# EasyEDA Pro project GController.eprj, schematic NController, sheets 1 to 4 of 17

## Sheets
1 PowerSupply: Board Name: Board1; Create Date: 2024-08-13
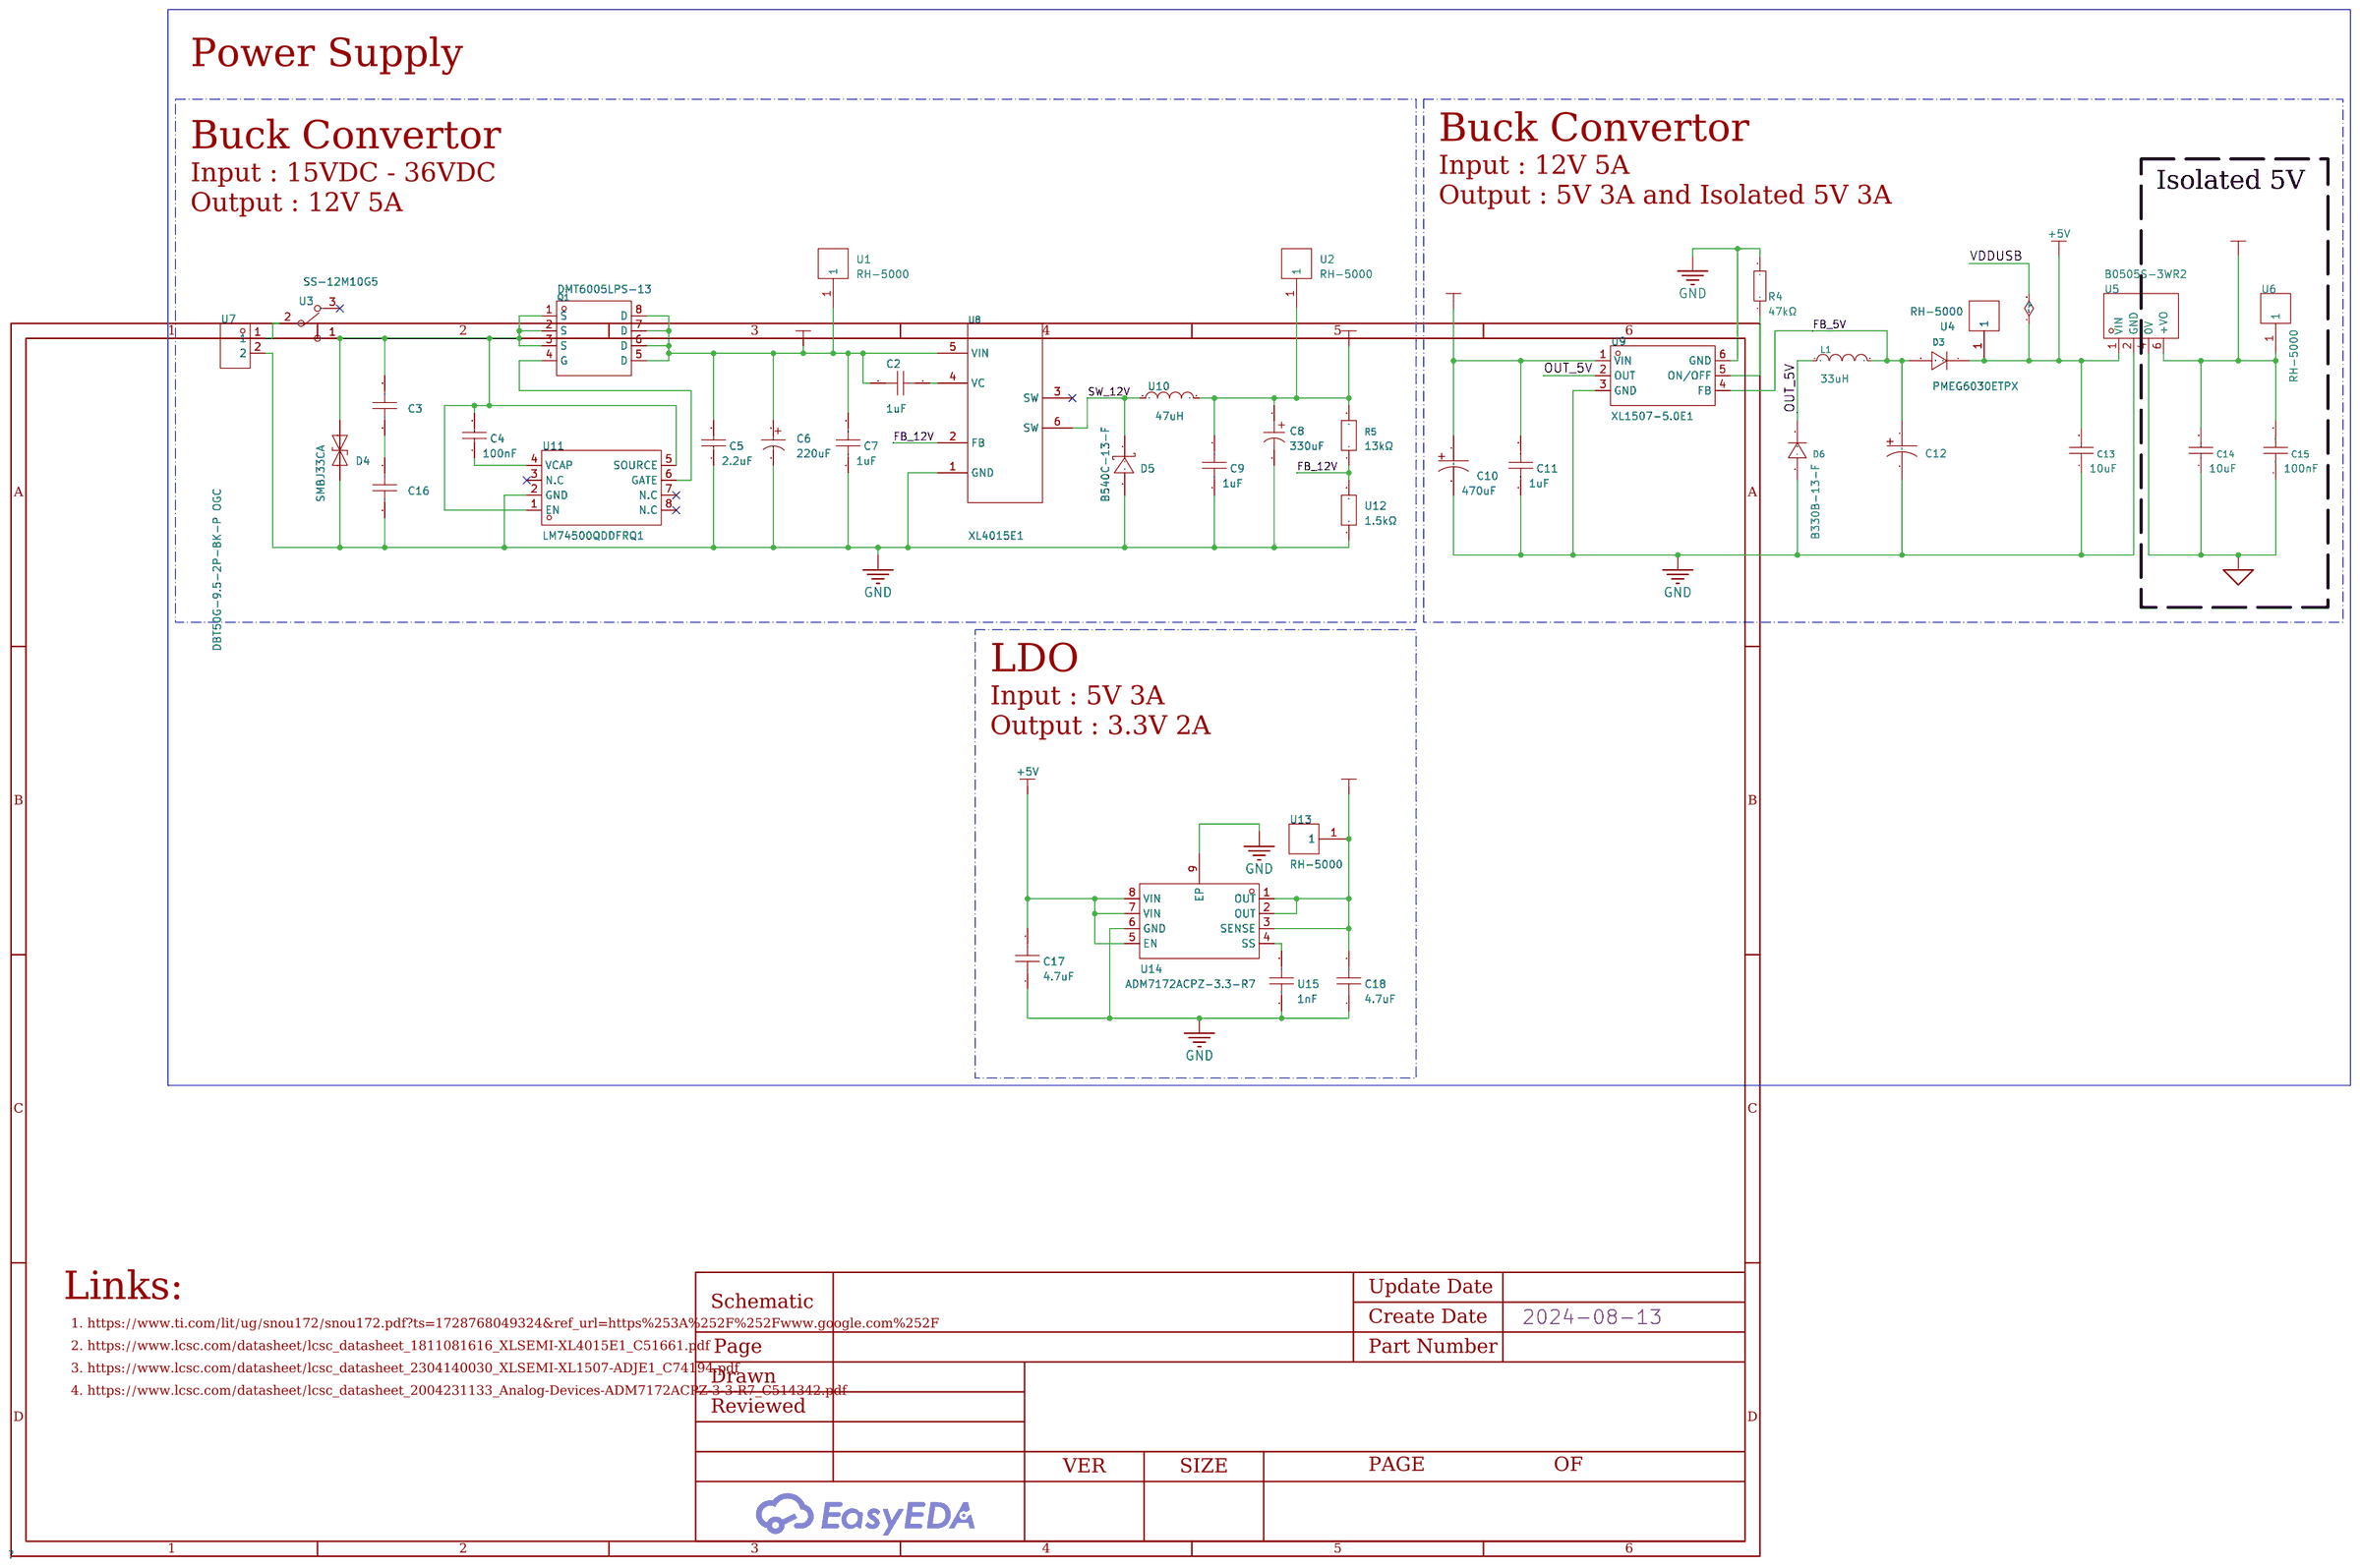
[diagram p0: PowerSupply]
2 ESP32-Display: Create Date: 2024-08-16
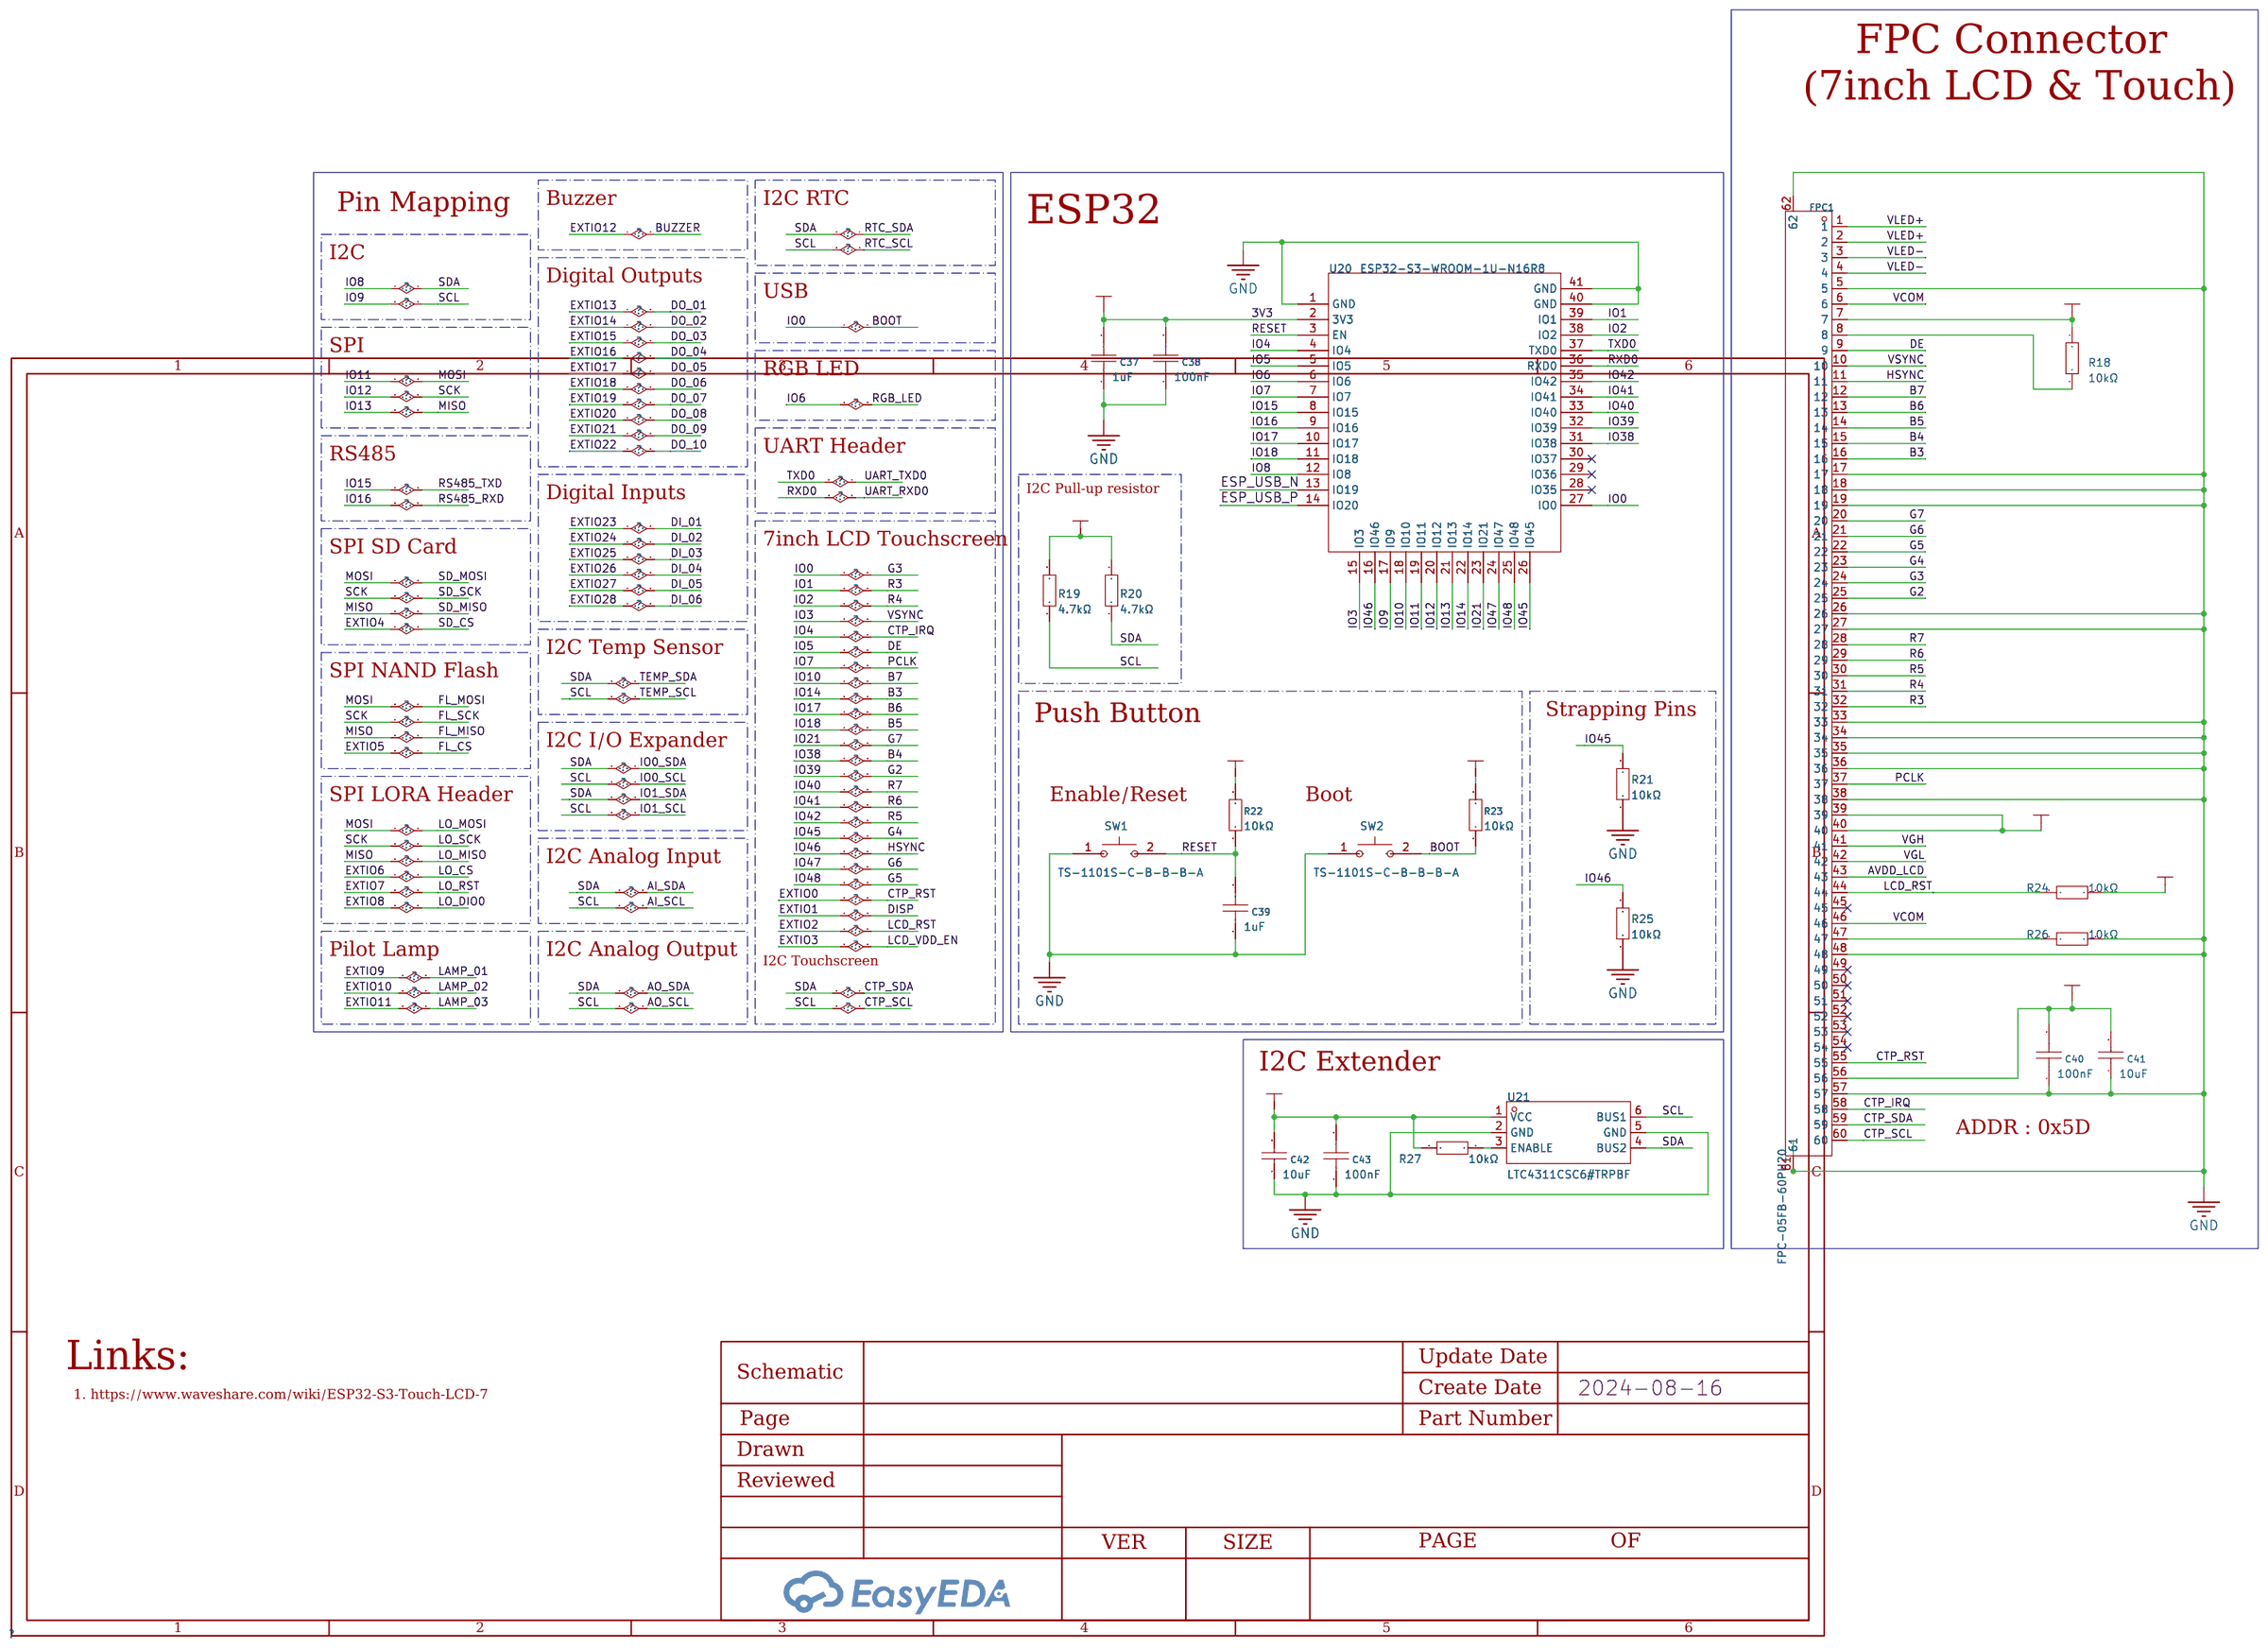
[diagram p1: ESP32-Display]
3 USB: Create Date: 2024-08-16
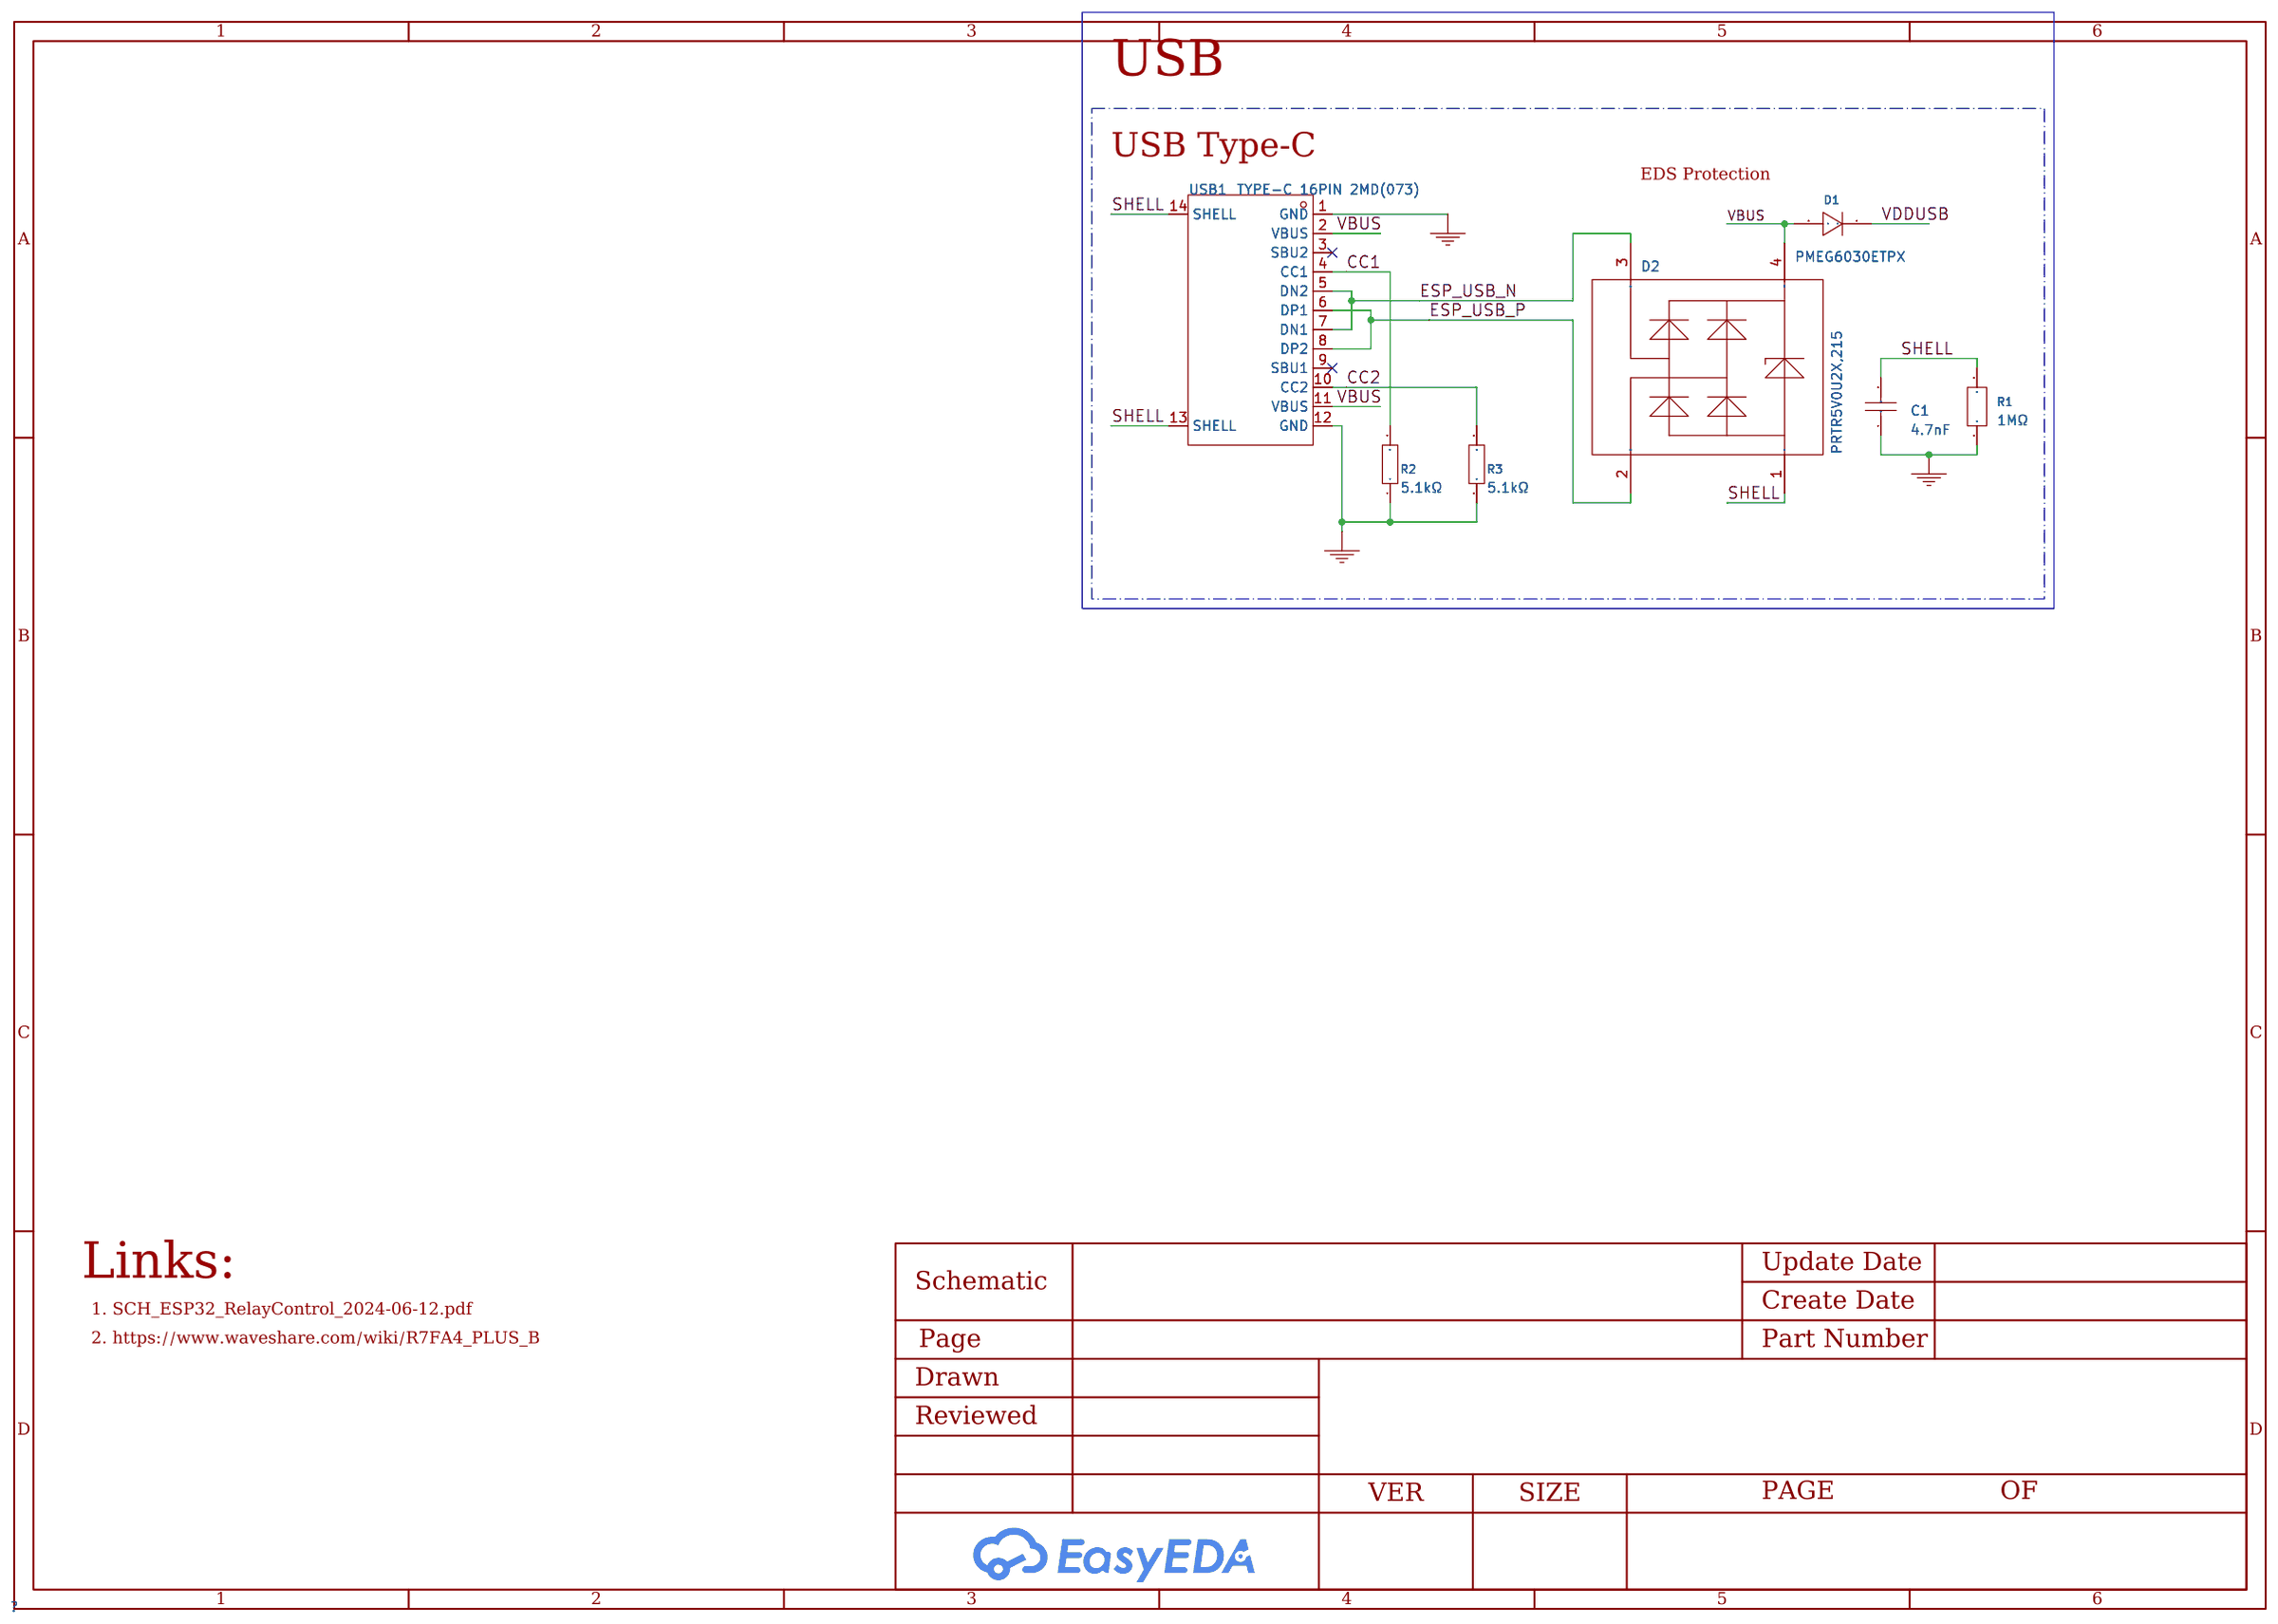
[diagram p2: USB]
4 Touchscreen-PowerSupply: Create Date: 2024-08-28
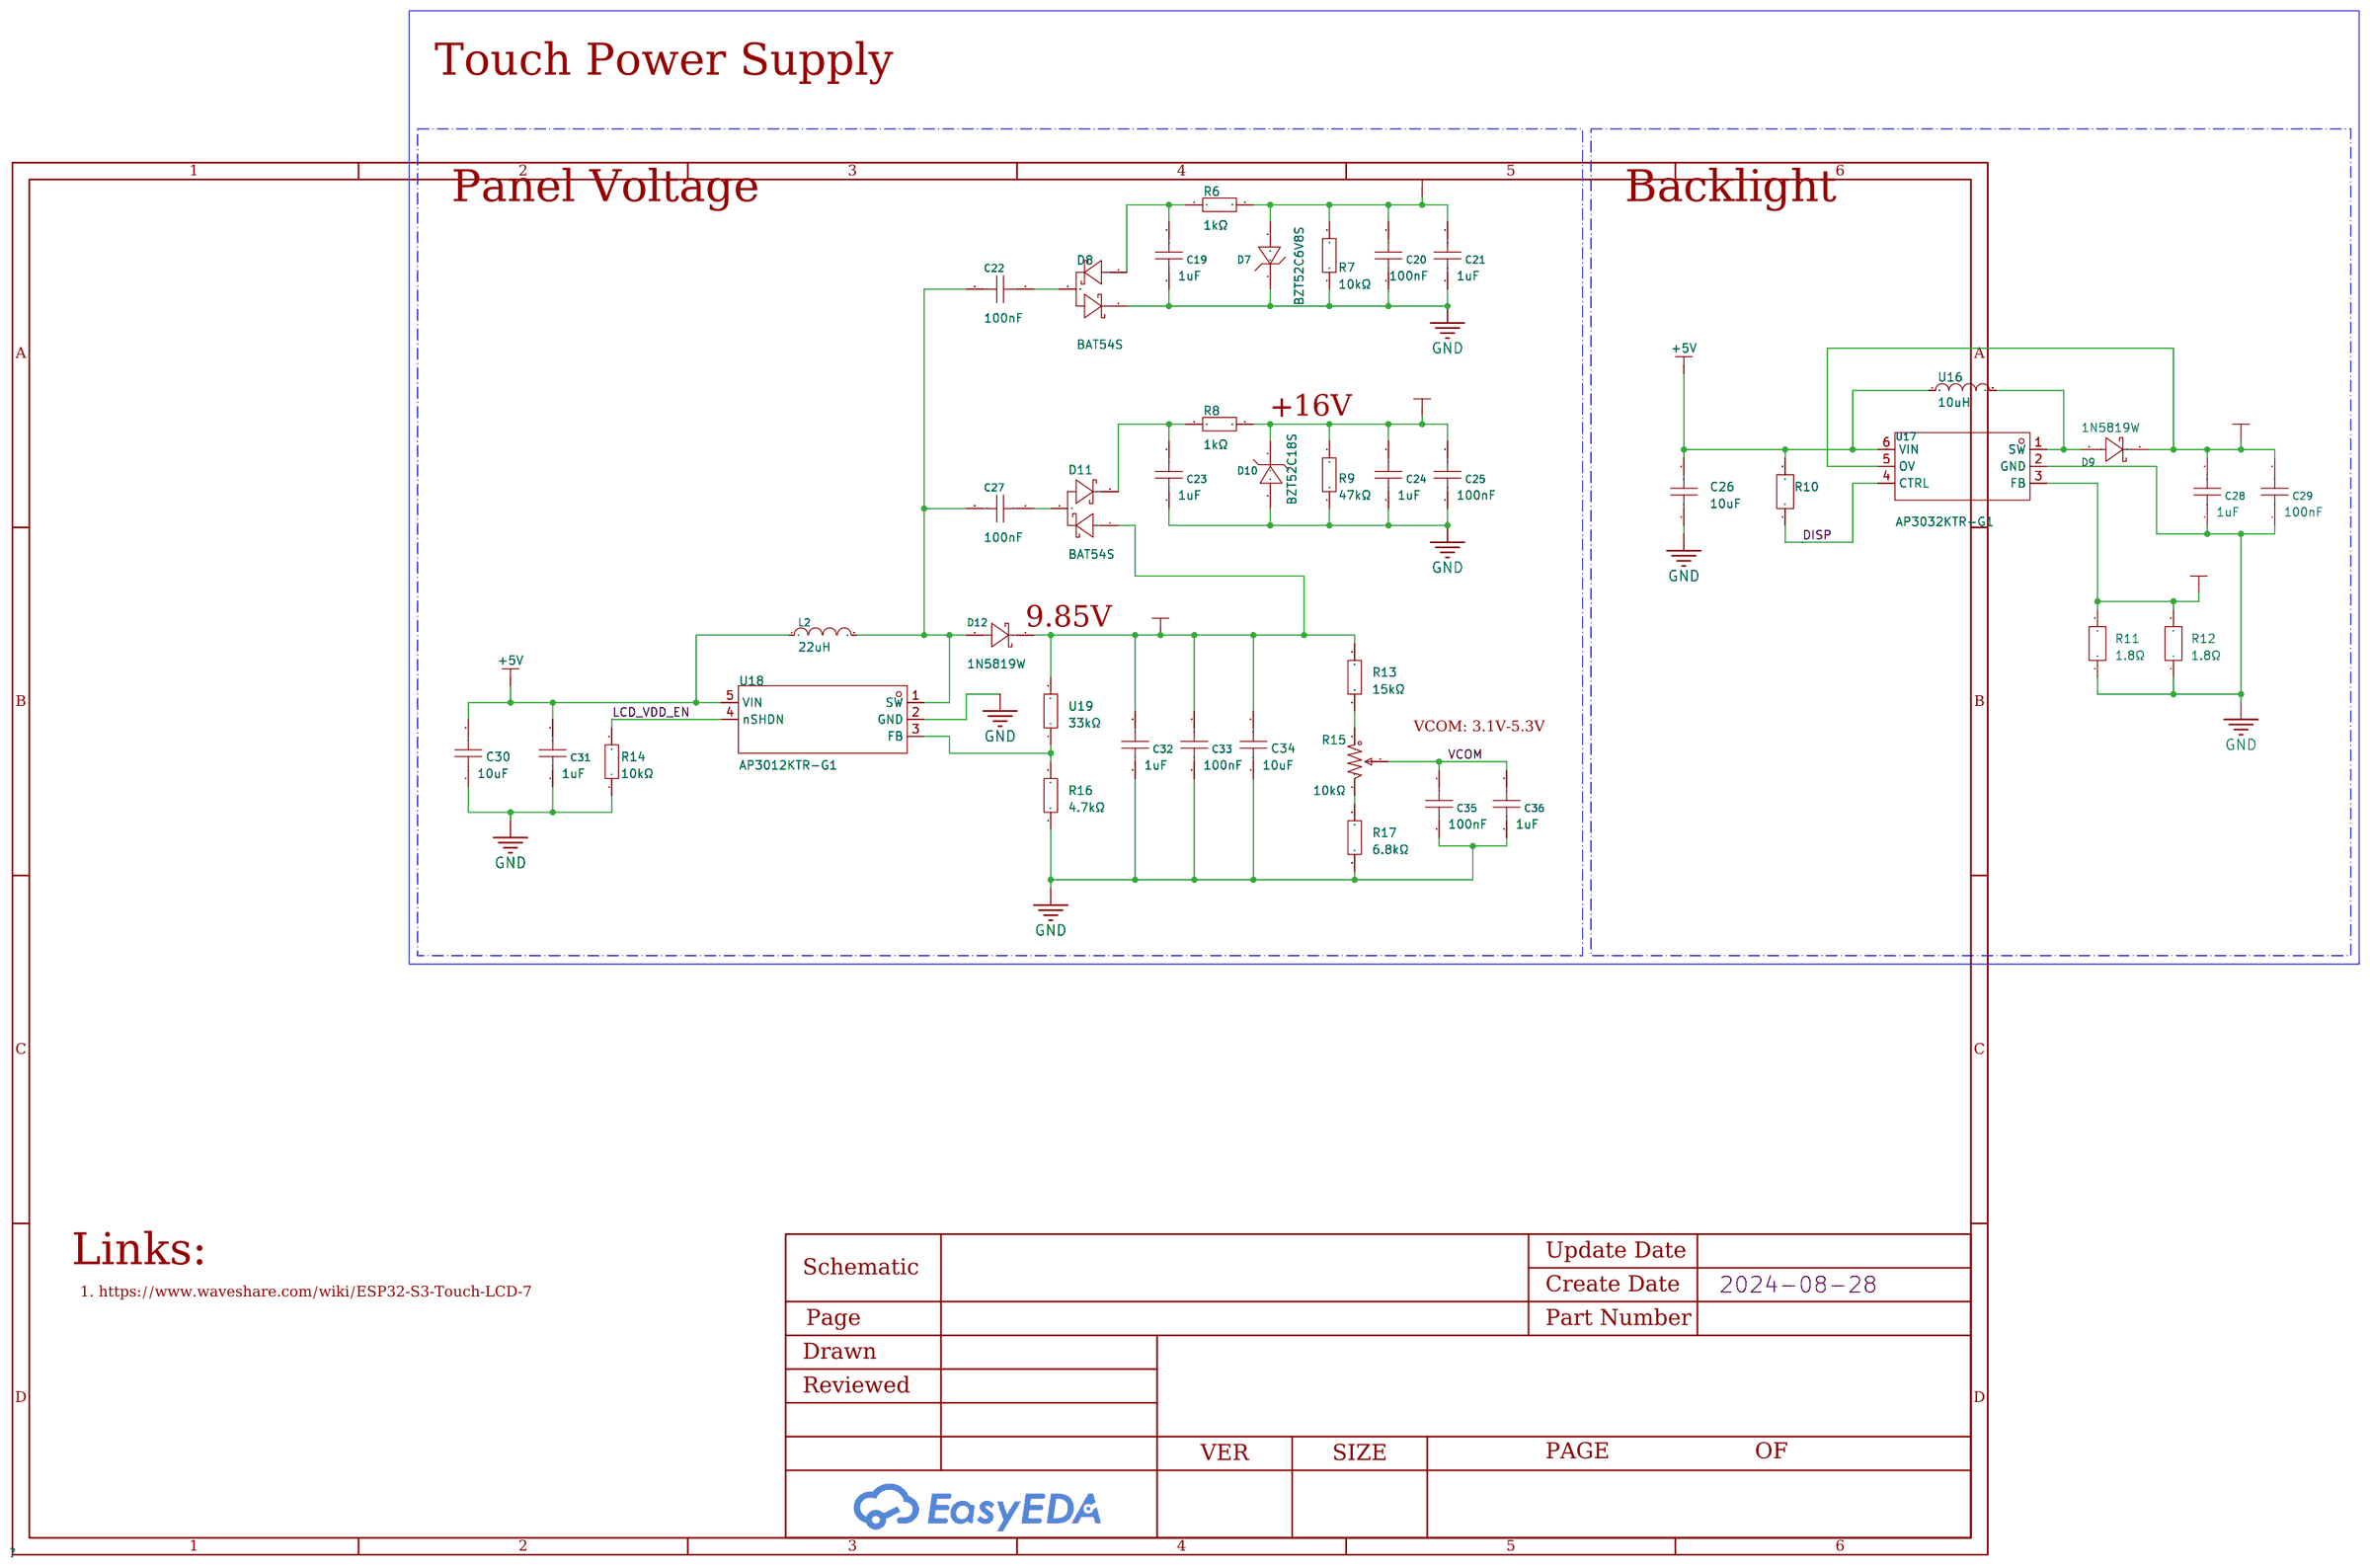
[diagram p3: Touchscreen-PowerSupply]

## Parts
sheet ESP32-Display
C37  1uF  [C0603]
C38  100nF  [C0603]
C39  1uF  [C0603]
C40  100nF  [C0402]
C41  10uF  [C0402]
C42  10uF  [C0402]
C43  100nF  [C0402]
FPC1  FPC-05FB-60PH20  [FPC-SMD_60P-P0.50_FPC-05FB-60PH20]
R18  10kΩ  [R0603]
R19  4.7kΩ  [R0603]
R20  4.7kΩ  [R0603]
R21  10kΩ  [R0603]
R22  10kΩ  [R0603]
R23  10kΩ  [R0603]
R24  10kΩ  [R0603]
R25  10kΩ  [R0603]
R26  10kΩ  [R0603]
R27  10kΩ  [R0402]
SW1  TS-1101S-C-B-B-B-A  [SW-SMD_L6.0-W3.5-LS8.0]
SW2  TS-1101S-C-B-B-B-A  [SW-SMD_L6.0-W3.5-LS8.0]
U20  ESP32-S3-WROOM-1U-N16R8  [WIRELM-SMD_ESP32-S3-WROOM-1U]
U21  LTC4311CSC6#TRPBF  [SC-70-6_L2.1-W1.3-P0.65-LS2.1-BR]
sheet PowerSupply
C2  1uF  [C0805]
C3  330nF  [C1206]
C4  100nF  [C0603]
C5  2.2uF  [C1210]
C6  220uF  [CAP-SMD_BD10.0-L10.3-W10.3-LS11.3-FD]
C7  1uF  [C0805]
C8  330uF  [CAP-SMD_BD6.3-L6.6-W6.6-LS7.3-FD]
C9  1uF  [C0805]
C10  470uF  [CAP-SMD_BD12.5-L13.0-W13.0-FD]
C11  1uF  [C0805]
C12  330uF  [CAP-SMD_BD10.0-L10.3-W10.3-LS11.3-FD]
C13  10uF  [C0805]
C14  10uF  [C0805]
C15  100nF  [C0805]
C16  330nF  [C1206]
C17  4.7uF  [C0805]
C18  4.7uF  [C0805]
D3  PMEG6030ETPX  [SOD-128_L3.7-W2.5-LS4.7-RD]
D4  SMBJ33CA  [SMB_L4.3-W3.6-LS5.4-BI]
D5  B540C-13-F  [SMC_L7.1-W6.2-LS8.1-RD]
D6  B330B-13-F  [SMB_L4.6-W3.6-LS5.3-RD]
L1  33uH  [IND-SMD_L12.0-W12.0]
Q1  DMT6005LPS-13  [DFN-8_L6.0-W5.1-P1.27-LS6.2-BL]
R4  47kΩ  [R0805]
R5  13kΩ  [R0805]
U1  RH-5000  [TEST-TH_BD2.54-P1.4_RED]
U2  RH-5000  [TEST-TH_BD2.54-P1.4_RED]
U3  SS-12M10G5  [SW-TH_XKB_SS-12M10G5]
U4  RH-5000  [TEST-TH_BD2.54-P1.4_RED]
U5  B0505S-3WR2  [PWRM-TH_B0505S-3WR2]
U6  RH-5000  [TEST-TH_BD2.54-P1.4_RED]
U7  DBT50G-9.5-2P-BK-P OGC  [CONN-TH_2P-P9.50_DBT50G-9.5-2P]
U8  XL4015E1  [TO-263-5_L10.2-W8.9-P1.70-TL]
U9  XL1507-5.0E1  [TO-252-5_L6.5-W5.6-P1.27-LS9.5-TL]
U10  47uH  [IND-SMD_L13.5-W12.5]
U11  LM74500QDDFRQ1  [SOT-23-8_L3.0-W1.7-P0.65-LS2.8-BR]
U12  1.5kΩ  [R0805]
U13  RH-5000  [TEST-TH_BD2.54-P1.4_RED]
U14  ADM7172ACPZ-3.3-R7  [DFN-8_L3.0-W3.0-P0.50-BL-EP]
U15  1nF  [C0805]
sheet Touchscreen-PowerSupply
C19  1uF  [C0603]
C20  100nF  [C0603]
C21  1uF  [C0603]
C22  100nF  [C0603]
C23  1uF  [C0603]
C24  1uF  [C0603]
C25  100nF  [C0603]
C26  10uF  [C0805]
C27  100nF  [C0603]
C28  1uF  [C0603]
C29  100nF  [C0603]
C30  10uF  [C0805]
C31  1uF  [C0603]
C32  1uF  [C0603]
C33  100nF  [C0603]
C34  10uF  [C0805]
C35  100nF  [C0603]
C36  1uF  [C0603]
D7  BZT52C6V8S  [SOD-323_L1.8-W1.3-LS2.5-RD]
D8  BAT54S  [SOT-23-3_L2.9-W1.3-P1.90-LS2.4-BR]
D9  1N5819W  [SOD-123_L2.8-W1.8-LS3.7-RD]
D10  BZT52C18S  [SOD-323_L1.8-W1.3-LS2.5-RD]
D11  BAT54S  [SOT-23-3_L2.9-W1.3-P1.90-LS2.4-BR]
D12  1N5819W  [SOD-123_L2.8-W1.8-LS3.7-RD]
L2  22uH  [IND-SMD_L4.9-W4.9_NRS50XX]
R6  1kΩ  [R0603]
R7  10kΩ  [R0603]
R8  1kΩ  [R0603]
R9  47kΩ  [R0603]
R10  4.7kΩ  [R0603]
R11  1.8Ω  [R0805]
R12  1.8Ω  [R0805]
R13  15kΩ  [R0603]
R14  10kΩ  [R0603]
R15  10kΩ  [RES-ADJ-SMD_3P-L3.0-W3.8-P1.75-BR]
R16  4.7kΩ  [R0603]
R17  6.8kΩ  [R0603]
U16  10uH  [IND-SMD_L4.4-W4.2_BCIHP0412SC]
U17  AP3032KTR-G1  [SOT-23-6_L2.9-W1.6-P0.95-LS2.8-BR]
U18  AP3012KTR-G1  [TSOT-23-5_L2.9-W1.6-P0.95-LS2.8-BL]
U19  33kΩ  [R0603]
sheet USB
C1  4.7nF  [C1206]
D1  PMEG6030ETPX  [SOD-128_L3.7-W2.5-LS4.7-RD]
D2  PRTR5V0U2X,215  [SOT-143_L2.9-W1.3-P1.92-LS2.3-BR]
R1  1MΩ  [R0402]
R2  5.1kΩ  [R0402]
R3  5.1kΩ  [R0402]
USB1  TYPE-C 16PIN 2MD(073)  [USB-C-SMD_TYPE-C-6PIN-2MD-073]

## Library data of the parts
C19 C21 C23 C24 C28 C31 C32 C36 C37 C39 = C0603X5R105K250NT: Capacitance: Tolerance:±10% Tolerance:±10% Voltage Rated: Temperature Coefficient:; LCSC Part Name: 1uF ±10% 25V; Supplier Part: C466771; Manufacturer: SANYEAR(叁叶源); Supplier Footprint: 0603; JLCPCB Part Class: Extended Part; Datasheet: https://atta.szlcsc.com/upload/public/pdf/source/20200102/C475251_1E30ECAC0E8AE7254982658A02A2D78C.pdf; Supplier: LCSC; Tolerance: ±10%
C38 = CL10B104KB8NNNC: Capacitance: Tolerance:±10% Tolerance:±10% Voltage Rated: Temperature Coefficient:; LCSC Part Name: 100nF ±10% 50V; Supplier Part: C1591; Manufacturer: SAMSUNG(三星); Supplier Footprint: 0603; JLCPCB Part Class: Extended Part; Datasheet: https://atta.szlcsc.com/upload/public/pdf/source/20160218/1457707763339.pdf; Supplier: LCSC; Tolerance: ±10%
C40 C43 = GRM155R71H104KE14D: LCSC Part Name: 100nF ±10% 50V; Supplier Part: C77020; Manufacturer: muRata(村田); Supplier Footprint: 0402; JLCPCB Part Class: Extended Part; Datasheet: https://atta.szlcsc.com/upload/public/pdf/source/20180326/C77020_39BD49C951FF1AF0DB1F1FAC5AC1E401.pdf; Supplier: LCSC; Tolerance: ±10%
C41 C42 = CL05A106MQ5NUNC: LCSC Part Name: 10uF ±20% 6.3V; Supplier Part: C15525; Manufacturer: SAMSUNG(三星); Supplier Footprint: 0402; JLCPCB Part Class: Basic Part; Datasheet: https://atta.szlcsc.com/upload/public/pdf/source/20220823/2B02EE04F8F211D38A52DCB16EB6BEBA.pdf; Supplier: LCSC; Tolerance: ±20%
FPC1 = FPC-05FB-60PH20: LCSC Part Name: 间距:0.5mm P数:60P 翻盖式 双侧触点/上下接; Supplier Part: C2856839; Manufacturer: XUNPU(讯普); Supplier Footprint: SMD,P=0.5mm,卧贴; JLCPCB Part Class: Extended Part; Datasheet: https://atta.szlcsc.com/upload/public/pdf/source/20210922/C2856839_B700DB1A2B95976B214AB1FEFC031E2B.pdf; Supplier: LCSC; Locking Feature: Clamshell; Contact Type: Double-sided contacts/up and down connection; Number of Contacts: 60P; Pitch: 0.5mm; Mounting Type: 卧贴; FFC, FCB Thickness: 0.3mm; Height Above Board: 2mm; Operating Temperature Range: -25℃~+85℃
R7 R14 R18 R21 R24-R26 = RC0603FR-0710KL: Type:Thick Film Resistors Resistance: Tolerance:±1% Tolerance:±1% Power(Watts): Overload Voltage (Max): Temperature Coefficient:±100ppm/℃ Temperature Coefficient:±100ppm/℃ Operating Temperature Range:-55℃~+155℃ Operating Temperature Range:-55℃~+155℃; LCSC Part Name: 厚膜电阻 10kΩ ±1% 100mW; Supplier Part: C98220; Manufacturer: YAGEO(国巨); Supplier Footprint: 0603; JLCPCB Part Class: Extended Part; Datasheet: https://atta.szlcsc.com/upload/public/pdf/source/20180927/C295883_E8D83085EA81BD7DE0B2B681138C15EE.pdf; Supplier: LCSC; Type: Thick Film Resistors; Tolerance: ±1%; Temperature Coefficient: ±100ppm/℃; Operating Temperature Range: -55℃~+155℃
R16 R19 R20 = RC0603FR-074K7L: Type:Thick Film Resistors Resistance: Tolerance:±1% Tolerance:±1% Power(Watts): Overload Voltage (Max): Temperature Coefficient:±100ppm/℃ Temperature Coefficient:±100ppm/℃ Operating Temperature Range:-55℃~+155℃ Operating Temperature Range:-55℃~+155℃; LCSC Part Name: 厚膜电阻 4.7kΩ ±1% 100mW; Supplier Part: C99782; Manufacturer: YAGEO(国巨); Supplier Footprint: 0603; JLCPCB Part Class: Extended Part; Datasheet: https://atta.szlcsc.com/upload/public/pdf/source/20180224/C181757_15194369480721363983.pdf; Supplier: LCSC; Type: Thick Film Resistors; Tolerance: ±1%; Temperature Coefficient: ±100ppm/℃; Operating Temperature Range: -55℃~+155℃
R22 R23 = CR0603FA1002G: Type:Thick Film Resistors Resistance: Tolerance:±1% Tolerance:±1% Power(Watts): Overload Voltage (Max): Temperature Coefficient:±100ppm/℃ Temperature Coefficient:±100ppm/℃ Operating Temperature Range:-55℃~+125℃ Operating Temperature Range:-55℃~+125℃; LCSC Part Name: 厚膜电阻 10kΩ ±1% 100mW; Supplier Part: C126901; Manufacturer: LIZ(丽智电子); Supplier Footprint: 0603; JLCPCB Part Class: Extended Part; Datasheet: https://atta.szlcsc.com/upload/public/pdf/source/20180403/C189438_6D658388CC7843F35BBC9018D03F0B8E.pdf; Supplier: LCSC; Type: Thick Film Resistors; Tolerance: ±1%; Temperature Coefficient: ±100ppm/℃; Operating Temperature Range: -55℃~+125℃
R27 = RC0402FR-0710KL: LCSC Part Name: 厚膜电阻 10kΩ ±1% 62.5mW; Supplier Part: C60490; Manufacturer: YAGEO(国巨); Supplier Footprint: 0402; JLCPCB Part Class: Extended Part; Datasheet: https://atta.szlcsc.com/upload/public/pdf/source/20170925/C131467_1506321478108990263.pdf; Supplier: LCSC; Type: Thick Film Resistors; Tolerance: ±1%; Temperature Coefficient: ±100ppm/℃; Operating Temperature Range: -55℃~+155℃
SW1 SW2 = TS-1101S-C-B-B-B-A: Circuit:SPST Actuator Style:Rectangle button Operating Force:260gf Mounting Style:Brick nogging Switch Length:6mm Switch Width:3.5mm Switch Height:5mm Strike Gundam:不带 Contact Current:50mA Voltage Rating (DC):12V Insulation Resistance:- Actuator/Cap Color; LCSC Part Name: 6*3.5*5mm 立贴 轻触开关; Supplier Part: C609852; Manufacturer: XKB Connectivity(中国星坤); Supplier Footprint: SMD; JLCPCB Part Class: Extended Part; Datasheet: https://atta.szlcsc.com/upload/public/pdf/source/20211011/FB5BEC18F2E7B990941A3F47A2FD4F18.pdf; Supplier: LCSC; Circuit: SPST; Actuator Style: Rectangle button; Operating Force: 260gf; Mounting Style: Brick nogging; Switch Length: 6mm; Switch Width: 3.5mm; Switch Height: 5mm; Strike Gundam: 不带; Contact Current: 50mA; Voltage Rating (DC): 12V; Actuator/Cap Color: Black; With Lamp: No; Mechanical Life: 5万次; Operating Temperature: -20℃~+70℃
U20 = ESP32-S3-WROOM-1U-N16R8: Supplier Part: C3013946; Manufacturer: ESPRESSIF(乐鑫); Supplier Footprint: SMD,18x19.2mm; JLCPCB Part Class: Extended Part; Datasheet: https://atta.szlcsc.com/upload/public/pdf/source/20240130/9D71F4DF55874C504AB629FEEE3F038E.pdf; Supplier: LCSC
U21 = LTC4311CSC6#TRPBF: LCSC Part Name: 低电压 I2C/SMBus 加速器; Supplier Part: C580856; Manufacturer: ADI(亚德诺); Supplier Footprint: SC-70-6; JLCPCB Part Class: Extended Part; Datasheet: https://atta.szlcsc.com/upload/public/pdf/source/20200917/C688093_6F50F7943BC708E0A1A0977BB3FF79B5.pdf; Supplier: LCSC; Type: Accelerator; Input Type: 2-WireBus; Output Type: 2-WireBus; Supply Voltage: 1.6V~5.5V; Number of Channels: 1; Operating Temperature: 0℃~+70℃; Application: I2C
C2 C7 C9 C11 = 0805B105K500NT_C215803: Capacitance:1uF Tolerance:±10% Tolerance:±10% Voltage Rated: Temperature Coefficient:; LCSC Part Name: 1uF ±10% 50V; Supplier Part: C215803; Manufacturer: FH(风华); Manufacturer Part: 0805B105K500NT; Supplier Footprint: 0805; JLCPCB Part Class: Extended Part; Datasheet: https://atta.szlcsc.com/upload/public/pdf/source/20180530/C215803_D57791C2287FC18831C4E0C7838E6BEC.pdf; Supplier: LCSC; Tolerance: ±10%
C3 C16 = CC1206KRX7R9BB334: Capacitance: Tolerance:±10% Tolerance:±10% Voltage Rated: Temperature Coefficient:; LCSC Part Name: 330nF ±10% 50V; Supplier Part: C274377; Manufacturer: YAGEO(国巨); Supplier Footprint: 1206; JLCPCB Part Class: Extended Part; Datasheet: https://atta.szlcsc.com/upload/public/pdf/source/20181008/C309510_22F155564471FAF6A489F7D68F34234E.pdf; Supplier: LCSC; Tolerance: ±10%
C4 = CL10B104KA8NNNC: LCSC Part Name: 100nF ±10% 25V; Supplier Part: C1590; Manufacturer: SAMSUNG(三星); Supplier Footprint: 0603; JLCPCB Part Class: Extended Part; Datasheet: https://atta.szlcsc.com/upload/public/pdf/source/20160218/1457707763339.pdf; Supplier: LCSC; Tolerance: ±10%
C5 = CL32B225KCJSNNE: LCSC Part Name: 2.2uF ±10% 100V; Supplier Part: C55151; Manufacturer: SAMSUNG(三星); Supplier Footprint: 1210; JLCPCB Part Class: Extended Part; Datasheet: https://atta.szlcsc.com/upload/public/pdf/source/20160218/1457707763339.pdf; Supplier: LCSC; Tolerance: ±10%
C6 = RVT1H221M1010_C72499: Capacitance: Tolerance:±20% Tolerance:±20% Rated Voltage: Ripple Current:230mA@120Hz Equivalent Series Resistance(ESR):- φD: L: Lifetime @ Temp:2000hrs@105℃ Operating Temperature:-40℃~+105℃ Operating Temperature:-40℃~+105℃; LCSC Part Name: 220uF ±20% 50V; Supplier Part: C72499; Manufacturer: ROQANG(容强); Manufacturer Part: RVT1H221M1010; Supplier Footprint: SMD,D10xL10.2mm; JLCPCB Part Class: Extended Part; Datasheet: https://atta.szlcsc.com/upload/public/pdf/source/20170325/1490427950282.pdf; Supplier: LCSC; Tolerance: ±20%; Ripple Current: 230mA@120Hz; Lifetime @ Temp: 2000hrs@105℃; Operating Temperature: -40℃~+105℃
C8 = GVM1E331M0607: LCSC Part Name: 330uF ±20% 25V; Supplier Part: C2980171; Manufacturer: HONOR(荣誉); Supplier Footprint: SMD,D6.3xL7.7mm; JLCPCB Part Class: Extended Part; Datasheet: https://atta.szlcsc.com/upload/public/pdf/source/20220509/EB2A569F0F3393644DE07704993C28AA.pdf; Supplier: LCSC; Tolerance: ±20%; Lifetime @ Temp: 2000hrs@105℃; Operating Temperature: -55℃~+105℃
C10 = VT1H471MI135000CE0: LCSC Part Name: 470uF ±20% 50V; Supplier Part: C191227; Manufacturer: HUAWEI(华威集团); Supplier Footprint: SMD,D12.5xL13.5mm; JLCPCB Part Class: Extended Part; Datasheet: https://atta.szlcsc.com/upload/public/pdf/source/20180905/C271440_3CFD575A076F93250B03C17D9BA3B978.pdf; Supplier: LCSC; Tolerance: ±20%; Lifetime @ Temp: 1000hrs@105℃; Operating Temperature: -40℃~+105℃
C12 = RVE1V331M1010_C88682: Capacitance: Tolerance:±20% Tolerance:±20% Rated Voltage: Ripple Current:- Equivalent Series Resistance(ESR):- φD: L: Lifetime @ Temp:2000hrs@105℃ Operating Temperature:-55℃~+105℃ Operating Temperature:-55℃~+105℃; LCSC Part Name: 330uF ±20% 35V; Supplier Part: C88682; Manufacturer: HONOR(荣誉); Manufacturer Part: RVE1V331M1010; Supplier Footprint: SMD,D10xL10.2mm; JLCPCB Part Class: Extended Part; Datasheet: https://atta.szlcsc.com/upload/public/pdf/source/20180326/C88681_F49340D40E14C975B06CFC1ADD63F7A4.pdf; Supplier: LCSC; Tolerance: ±20%; Lifetime @ Temp: 2000hrs@105℃; Operating Temperature: -55℃~+105℃
C13 C14 = CL21A106KOQNNNE: Capacitance: Tolerance:±10% Tolerance:±10% Voltage Rated: Temperature Coefficient:; LCSC Part Name: 10uF ±10% 16V; Supplier Part: C1713; Manufacturer: SAMSUNG(三星); Supplier Footprint: 0805; JLCPCB Part Class: Extended Part; Datasheet: https://atta.szlcsc.com/upload/public/pdf/source/20160218/1457707763339.pdf; Supplier: LCSC; Tolerance: ±10%
C15 = C0805B104K500NT: Capacitance: Tolerance:±10% Tolerance:±10% Voltage Rated: Temperature Coefficient:; LCSC Part Name: 100nF ±10% 50V; Supplier Part: C476766; Manufacturer: TORCH(火炬); Supplier Footprint: 0805; JLCPCB Part Class: Extended Part; Datasheet: https://atta.szlcsc.com/upload/public/pdf/source/20191230/C476766_171E30D5B7F7164A8210B8E948DFBAE0.pdf; Supplier: LCSC; Tolerance: ±10%
C17 C18 = HGC0805R7475K500NSLJ: LCSC Part Name: 4.7uF ±10% 50V; Supplier Part: C7472970; Manufacturer: Chinocera(华瓷); Supplier Footprint: 0805; JLCPCB Part Class: Extended Part; Datasheet: https://atta.szlcsc.com/upload/public/pdf/source/20240320/FAC3FEC40A78BC5CCCE96C232A94D860.pdf; Supplier: LCSC; Tolerance: ±10%; Voltage Rated: 50V
D1 D3 = PMEG6030ETPX: LCSC Part Name: 电压:60V 电流:3A; Supplier Part: C458168; Manufacturer: Nexperia(安世); Supplier Footprint: SOD-128; JLCPCB Part Class: Extended Part; Datasheet: https://atta.szlcsc.com/upload/public/pdf/source/20191121/C458168_3DBD69A204AC75E76FEF59A88011A92D.pdf; Supplier: LCSC; Forward Voltage (Vf@If): 530mV@3A; Reverse Voltage (Vr): 60V; Average Rectified Current (Io): 3A; Reverse Leakage Current (Ir): 200uA@60V
D4 = SMBJ33CA_C78420: Reverse Stand-Off Voltage (Vrwm):33V Maximum Clamping Voltage:53.3V Peak Pulse Current (Ipp)@10/1000us:11.3A Breakdown Voltage:36.7V Type:TVS; LCSC Part Name: 33V截止 11.3A峰值脉冲; Supplier Part: C78420; Manufacturer: Brightking(君耀电子); Supplier Footprint: SMB(DO-214AA); JLCPCB Part Class: Extended Part; Datasheet: https://atta.szlcsc.com/upload/public/pdf/source/20181127/C309995_EB3DFB9F9AEE5D2146ECD9FA5992A402.pdf; Supplier: LCSC; Reverse Stand-Off Voltage (Vrwm): 33V; Maximum Clamping Voltage: 53.3V; Peak Pulse Current (Ipp)@10/1000us: 11.3A; Breakdown Voltage: 36.7V; Type: TVS; polarity: Bi-Directional; Peak Pulse Power Dissipation (Ppp)@10/1000us: 600W
D5 = B540C-13-F: Forward Voltage (Vf@If):550mV@5A Reverse Voltage (Vr):40V Average Rectified Current (Io):5A Reverse Leakage Current (Ir):500uA@40V; LCSC Part Name: 电压:40V 电流:5A; Supplier Part: C72264; Manufacturer: DIODES(美台); Supplier Footprint: SMC(DO-214AB); JLCPCB Part Class: Extended Part; Datasheet: https://atta.szlcsc.com/upload/public/pdf/source/20171023/C134461_15087453602301052556.pdf; Supplier: LCSC; Forward Voltage (Vf@If): 550mV@5A; Reverse Voltage (Vr): 40V; Average Rectified Current (Io): 5A; Reverse Leakage Current (Ir): 500uA@40V
D6 = B330B-13-F: LCSC Part Name: 电压:30V 电流:3A; Supplier Part: C134450; Manufacturer: DIODES(美台); Supplier Footprint: SMB(DO-214AA); JLCPCB Part Class: Extended Part; Datasheet: https://atta.szlcsc.com/upload/public/pdf/source/20171023/C134455_15087453581191052550.pdf; Supplier: LCSC; Forward Voltage (Vf@If): 500mV@3A; Reverse Voltage (Vr): 30V; Average Rectified Current (Io): 3A; Reverse Leakage Current (Ir): 500uA@30V
L1 = SLH1207S330MTT: LCSC Part Name: 33uH ±20%; Supplier Part: C181844; Manufacturer: Sunltech(韩国顺磁); Supplier Footprint: SMD; JLCPCB Part Class: Extended Part; Datasheet: https://atta.szlcsc.com/upload/public/pdf/source/20180509/C216200_948378E1D3CCC25B70CFE5927CB2C576.pdf; Supplier: LCSC; Tolerance: ±20%
Q1 = DMT6005LPS-13: Supplier Part: C780843; Manufacturer: DIODES(美台); Supplier Footprint: DFN-8(5.1x6); JLCPCB Part Class: Extended Part; Datasheet: https://atta.szlcsc.com/upload/public/pdf/source/20200907/C780843_BB243DCE9D38AC8F9247AE6DAA9190FF.pdf; Supplier: LCSC
R4 = CR0805J80473G: Type:Thick Film Resistors Resistance: Tolerance:±5% Tolerance:±5% Power(Watts): Overload Voltage (Max): Temperature Coefficient:±200ppm/℃ Temperature Coefficient:±200ppm/℃ Operating Temperature Range:-55℃~+125℃ Operating Temperature Range:-55℃~+125℃; LCSC Part Name: 厚膜电阻 47kΩ ±5% 125mW; Supplier Part: C102018; Manufacturer: LIZ(丽智电子); Supplier Footprint: 0805; JLCPCB Part Class: Extended Part; Datasheet: https://atta.szlcsc.com/upload/public/pdf/source/20180403/C189438_6D658388CC7843F35BBC9018D03F0B8E.pdf; Supplier: LCSC; Type: Thick Film Resistors; Tolerance: ±5%; Temperature Coefficient: ±200ppm/℃; Operating Temperature Range: -55℃~+125℃
R5 = ERA6AEB133V: LCSC Part Name: 13kΩ ±0.1% 125mW 薄膜电阻; Supplier Part: C445658; Manufacturer: PANASONIC(松下); Supplier Footprint: 0805; JLCPCB Part Class: Extended Part; Supplier: LCSC; Type: Thin Film Resistor; Tolerance: ±0.1%; Temperature Coefficient: ±25ppm/℃; Operating Temperature Range: -55℃~+155℃
U1 U2 U4 U6 U13 = RH-5000: LCSC Part Name: PCB电路板测试点/测试针; Supplier Part: C5277086; Manufacturer: 荣和; JLCPCB Part Class: Extended Part; Datasheet: https://atta.szlcsc.com/upload/public/pdf/source/20230704/1671C2774A3D6CEDC1FD6AAF48538C87.pdf; Supplier: LCSC
U3 = SS-12M10G5: LCSC Part Name: 柄长5mm 直插双档 滑动开关; Supplier Part: C2884788; Manufacturer: XKB Connection(中国星坤); Supplier Footprint: 插件; JLCPCB Part Class: Extended Part; Datasheet: https://atta.szlcsc.com/upload/public/pdf/source/20211009/707226F904F6C200A894718D0972768B.pdf; Supplier: LCSC; Circuit: Single Pole Double Throw (SPDT); Actuator Style: Rectangular column; Pin Style: PCPin; Switch Length: 13.2mm; Switch Width: 7.2mm; Switch Height: 6.6mm; Mounting Style: Direct Insert; Actuator Color: Black; Current Rating (DC): 6A; Voltage Rating (DC): 120V; Current Rating (AC): 6A; Voltage Rating (AC): 120V; Mechanical Life: 10,000 times; Operating Temperature: -40℃~+85℃
U5 = B0505S-3WR2_C5369498: LCSC Part Name: DC-DC 输入电压4.5V~5.5V 输出电压5V输出功率3W600mA; Supplier Part: C5369498; Manufacturer: YLPTEC(易川); Supplier Footprint: SIP-4; JLCPCB Part Class: Extended Part; Datasheet: https://atta.szlcsc.com/upload/public/pdf/source/20230417/78355FDB466A614ED9BF545F60A618F8.pdf; Supplier: LCSC
U7 = DBT50G-9.5-2P-BK-P OGC: Barrier Type:With Cover Plate Pitch:9.5mm Structure:1x2P Mounting Style:Straight Needle Pin Location:Corner Number of Pins:2P Number of Rows:1 Current Rating (Max):32A Voltage Rating (Max):750V Wire Gauge - AWG:12~22 Wire Gauge - mm2:4 Operating Temperatu; LCSC Part Name: 9.5mm 1x2P 每排P数:2 排数:1 直针 边脚; Supplier Part: C395958; Manufacturer: DORABO(地博电气); Supplier Footprint: 插件,P=9.5mm; JLCPCB Part Class: Extended Part; Datasheet: https://atta.szlcsc.com/upload/public/pdf/source/20230619/13ADDB604F78DE06B1EFD4F82CE20A46.pdf; Supplier: LCSC; Barrier Type: With Cover Plate; Pitch: 9.5mm; Structure: 1x2P; Mounting Style: Straight Needle; Pin Location: Corner; Number of Pins: 2P; Number of Rows: 1; Current Rating (Max): 32A; Voltage Rating (Max): 750V; Wire Gauge - AWG: 12~22; Wire Gauge - mm2: 4; Operating Temperature Range: -40℃~+105℃; Color: Black; Number of PINs Per Row: 2
U8 = XL4015E1: Supplier Part: C51661; Manufacturer: XLSEMI(芯龙); Supplier Footprint: TO-263-5; JLCPCB Part Class: Extended Part; Datasheet: https://atta.szlcsc.com/upload/public/pdf/source/20150618/1457707323461.pdf; Supplier: LCSC; Function: Step-down type; Switch tube (built-in/external): 内置
U9 = XL1507-5.0E1: Supplier Part: C74195; Manufacturer: XLSEMI(芯龙); Supplier Footprint: TO-252-5; JLCPCB Part Class: Extended Part; Datasheet: https://atta.szlcsc.com/upload/public/pdf/source/20160525/1464169836651.pdf; Supplier: LCSC
U10 = CXP1265-470M-HG(47UH): LCSC Part Name: 47uH ±20% 6.5A; Supplier Part: C7461747; Manufacturer: DMBJ(振宝佳); Supplier Footprint: SMD,D13.5xL12.5mm; JLCPCB Part Class: Extended Part; Supplier: LCSC; Tolerance: ±20%; Rated Current: 5A; Saturation Current (Isat): 6.5A
U11 = LM74500QDDFRQ1: LCSC Part Name: 反极性保护控制器; Supplier Part: C5219210; Manufacturer: TI(德州仪器); Supplier Footprint: SOT-23-8-THIN; JLCPCB Part Class: Extended Part; Datasheet: https://www.ti.com/cn/lit/gpn/lm74500-q1; Supplier: LCSC; Input Voltage: 3.2V~65V; Operating Temperature	-: -40℃~+125℃
U12 = ARG05BTC1501: LCSC Part Name: 薄膜电阻 1.5kΩ ±0.1% 125mW; Supplier Part: C2828734; Manufacturer: Viking(光颉); Supplier Footprint: 0805; JLCPCB Part Class: Extended Part; Datasheet: https://atta.szlcsc.com/upload/public/pdf/source/20211009/C2828883_CAE7D170B8B230FC4A048BDC7B3A81FC.pdf; Supplier: LCSC; Type: Thin Film Resistor; Tolerance: ±0.1%; Temperature Coefficient: ±25ppm/℃; Operating Temperature Range: -55℃~+155℃
U14 = ADM7172ACPZ-3.3-R7: LCSC Part Name: 输入6.5V 输出3.3V 2A; Supplier Part: C514342; Manufacturer: ADI(亚德诺); Supplier Footprint: LFCSP-8(3x3); JLCPCB Part Class: Extended Part; Datasheet: https://atta.szlcsc.com/upload/public/pdf/source/20200415/C514342_F56C054F4D9836E2AE1A905E0604845B.pdf; Supplier: LCSC; Maximum Input Voltage: 6.5V; Output Voltage: 3.3V; MAX Output Current: 2A; Power Supply Rejection Ratio (PSRR): 60dB@(1kHz); Dropout Voltage: 270mV@2A; standby current: 2mA; Noise: 6uVrms; Feature: enable；Soft start; Operating Temperature: -40℃~+125℃@(Tj); Output Polarity: Positive electrode; Number of Outputs: 1
U15 = FCC0805B102K102FT: LCSC Part Name: 1nF ±10% 1kV; Supplier Part: C5137645; Manufacturer: FOJAN(富捷); Supplier Footprint: 0805; JLCPCB Part Class: Extended Part; Datasheet: https://atta.szlcsc.com/upload/public/pdf/source/20220818/0EB3B7FB2F5648AC16609637FBA7DABE.pdf; Supplier: LCSC; Tolerance: ±10%
C20 C22 C25 C27 C29 C33 C35 = CC0603KRX7R9BB104: Capacitance: Tolerance:±10% Tolerance:±10% Voltage Rated: Temperature Coefficient:; LCSC Part Name: 100nF ±10% 50V; Supplier Part: C14663; Manufacturer: YAGEO(国巨); Supplier Footprint: 0603; JLCPCB Part Class: Basic Part; Datasheet: https://atta.szlcsc.com/upload/public/pdf/source/20180910/C282072_33301C7F631E79921B82A8DAC6BCC5B3.pdf; Supplier: LCSC; Tolerance: ±10%
C26 C30 C34 = CL21A106KAYNNNE_C15850: Capacitance: Tolerance:±10% Tolerance:±10% Voltage Rated: Temperature Coefficient:; LCSC Part Name: 10uF ±10% 25V; Supplier Part: C15850; Manufacturer: SAMSUNG(三星); Manufacturer Part: CL21A106KAYNNNE; Supplier Footprint: 0805; JLCPCB Part Class: Basic Part; Datasheet: https://atta.szlcsc.com/upload/public/pdf/source/20160218/1457707763339.pdf; Supplier: LCSC; Tolerance: ±10%
D7 = BZT52C6V8S_C266580: Supplier Part: C266580; Manufacturer: BORN(伯恩半导体); Supplier Footprint: SOD-323; JLCPCB Part Class: Extended Part; Datasheet: https://atta.szlcsc.com/upload/public/pdf/source/20180829/C266575_AED0603D8BB5155755942115610061C5.pdf; Supplier: LCSC; Diode Configuration: Single; Zener Voltage (Nom): 6.8V; Reverse Leakage Current (Ir): 2uA@4V; Zener Voltage (Range): 6.4V~7.2V; Power Dissipation: 200mW; Zener Impedance (Zzt): 15Ω
D8 D11 = BAT54S_C916425: Diode Configuration:1对串联式 Forward Voltage (Vf@If):800mV@100mA Reverse Voltage (Vr):30V Average Rectified Current (Io):200mA Reverse Leakage Current (Ir):2uA@25V; LCSC Part Name: 电压:30V 电流:200mA; Supplier Part: C916425; Manufacturer: JSMSEMI(杰盛微); Supplier Footprint: SOT-23; JLCPCB Part Class: Extended Part; Datasheet: https://atta.szlcsc.com/upload/public/pdf/source/20230807/4DC032BFF2527F74FFA5A2420773D8A6.pdf; Supplier: LCSC; Diode Configuration: 1对串联式; Forward Voltage (Vf@If): 800mV@100mA; Reverse Voltage (Vr): 30V; Average Rectified Current (Io): 200mA; Reverse Leakage Current (Ir): 2uA@25V
D9 D12 = 1N5819W_C727115: Diode Configuration:Single Forward Voltage (Vf@If):900mV@3A Reverse Voltage (Vr):40V Average Rectified Current (Io):1A Reverse Leakage Current (Ir):1mA@40V; LCSC Part Name: 电压:40V 电流:1A; Supplier Part: C727115; Manufacturer: TWGMC(台湾迪嘉); Supplier Footprint: SOD-123; JLCPCB Part Class: Extended Part; Datasheet: https://atta.szlcsc.com/upload/public/pdf/source/20220518/A32FD9482A1BC542ED9C09095620CB64.pdf; Supplier: LCSC; Diode Configuration: Single; Forward Voltage (Vf@If): 900mV@3A; Reverse Voltage (Vr): 40V; Average Rectified Current (Io): 1A; Reverse Leakage Current (Ir): 1mA@40V
D10 = BZT52C18S_C173446: Diode Configuration:Single Zener Voltage (Nom):18V Reverse Leakage Current (Ir):100nA@12.6V Zener Voltage (Range):16.8V~19.1V Zener Voltage (Range):16.8V~19.1V Power Dissipation:200mW Zener Impedance (Zzt):45Ω Tolerance:- Tolerance:-; Supplier Part: C173446; Manufacturer: MDD; Supplier Footprint: SOD-323; JLCPCB Part Class: Extended Part; Datasheet: https://atta.szlcsc.com/upload/public/pdf/source/20230823/808D44843A9B65A969625980AC8C1BE8.pdf; Supplier: LCSC; Diode Configuration: Single; Zener Voltage (Nom): 18V; Reverse Leakage Current (Ir): 100nA@12.6V; Zener Voltage (Range): 16.8V~19.1V; Power Dissipation: 200mW; Zener Impedance (Zzt): 45Ω
L2 = NRS5020T220MMGJV: Inductance: Tolerance:±20% Tolerance:±20% Rated Current: Saturation Current (Isat):900mA DC Resistance (DCR): Type:- Ratings:AEC-Q200; LCSC Part Name: 22uH ±20% 900mA; Supplier Part: C515385; Manufacturer: TAIYO YUDEN(太诱); Supplier Footprint: SMD,4.9x4.9mm; JLCPCB Part Class: Extended Part; Datasheet: https://atta.szlcsc.com/upload/public/pdf/source/20190329/C222848_0E03677360B3A1898B651728462F6FFE.pdf; Supplier: LCSC; Tolerance: ±20%; Saturation Current (Isat): 900mA; Ratings: AEC-Q200
R6 R8 = RC0603FR-071KL: Type:Thick Film Resistors Resistance: Tolerance:±1% Tolerance:±1% Power(Watts): Overload Voltage (Max): Temperature Coefficient:±100ppm/℃ Temperature Coefficient:±100ppm/℃ Operating Temperature Range:-55℃~+155℃ Operating Temperature Range:-55℃~+155℃; LCSC Part Name: 厚膜电阻 1kΩ ±1% 100mW; Supplier Part: C22548; Manufacturer: YAGEO(国巨); Supplier Footprint: 0603; JLCPCB Part Class: Extended Part; Datasheet: https://atta.szlcsc.com/upload/public/pdf/source/20180316/70C0E2BDAE7FCC62C531A5A58D202EE1.pdf; Supplier: LCSC; Type: Thick Film Resistors; Tolerance: ±1%; Temperature Coefficient: ±100ppm/℃; Operating Temperature Range: -55℃~+155℃
R9 = RC0603FR-0747KL: Type:Thick Film Resistors Resistance: Tolerance:±1% Tolerance:±1% Power(Watts): Overload Voltage (Max): Temperature Coefficient:±100ppm/℃ Temperature Coefficient:±100ppm/℃ Operating Temperature Range:-55℃~+155℃ Operating Temperature Range:-55℃~+155℃; LCSC Part Name: 厚膜电阻 47kΩ ±1% 100mW; Supplier Part: C105579; Manufacturer: YAGEO(国巨); Supplier Footprint: 0603; JLCPCB Part Class: Extended Part; Datasheet: https://atta.szlcsc.com/upload/public/pdf/source/20180316/70C0E2BDAE7FCC62C531A5A58D202EE1.pdf; Supplier: LCSC; Type: Thick Film Resistors; Tolerance: ±1%; Temperature Coefficient: ±100ppm/℃; Operating Temperature Range: -55℃~+155℃
R10 = ERA3VEB4701V: Type:Thin Film Resistor Resistance:4.7kΩ Tolerance:±0.1% Tolerance:±0.1% Power(Watts): Overload Voltage (Max): Temperature Coefficient:±25ppm/℃ Temperature Coefficient:±25ppm/℃ Operating Temperature Range:-55℃~+155℃ Operating Temperature Range:-55℃~+155℃; LCSC Part Name: 4.7kΩ ±0.1% 125mW 薄膜电阻; Supplier Part: C490795; Manufacturer: PANASONIC(松下); Supplier Footprint: 0603; JLCPCB Part Class: Extended Part; Datasheet: https://atta.szlcsc.com/upload/public/pdf/source/20200407/C490795_BD180C303136D23A530CEBEA0F60C9C2.pdf; Supplier: LCSC; Type: Thin Film Resistor; Tolerance: ±0.1%; Temperature Coefficient: ±25ppm/℃; Operating Temperature Range: -55℃~+155℃
R11 R12 = RC0805FR-071R8L: Type:Thick Film Resistors Resistance: Tolerance:±1% Tolerance:±1% Power(Watts): Overload Voltage (Max): Temperature Coefficient:±200ppm/℃ Temperature Coefficient:±200ppm/℃ Operating Temperature Range:-55℃~+155℃ Operating Temperature Range:-55℃~+155℃; LCSC Part Name: 厚膜电阻 1.8Ω ±1% 125mW; Supplier Part: C482990; Manufacturer: YAGEO(国巨); Supplier Footprint: 0805; JLCPCB Part Class: Extended Part; Datasheet: https://atta.szlcsc.com/upload/public/pdf/source/20200715/C482990_9DB74A2815C602721D2BD8256D955806.pdf; Supplier: LCSC; Type: Thick Film Resistors; Tolerance: ±1%; Temperature Coefficient: ±200ppm/℃; Operating Temperature Range: -55℃~+155℃
R13 = RT0603BRD0715KL: Type:Thin Film Resistor Resistance: Tolerance:±0.1% Tolerance:±0.1% Power(Watts): Overload Voltage (Max): Temperature Coefficient:±25ppm/℃ Temperature Coefficient:±25ppm/℃ Operating Temperature Range:-55℃~+155℃ Operating Temperature Range:-55℃~+155℃; LCSC Part Name: 薄膜电阻 15kΩ ±0.1% 100mW; Supplier Part: C326733; Manufacturer: YAGEO(国巨); Supplier Footprint: 0603; JLCPCB Part Class: Extended Part; Datasheet: https://atta.szlcsc.com/upload/public/pdf/source/20181031/C326733_EE8F7294E9D8CA9630183F76883336CF.pdf; Supplier: LCSC; Type: Thin Film Resistor; Tolerance: ±0.1%; Temperature Coefficient: ±25ppm/℃; Operating Temperature Range: -55℃~+155℃
R15 = TC33X-2-103E: LCSC Part Name: 10kΩ ±25%; Supplier Part: C719176; Manufacturer: BOURNS; Supplier Footprint: SMD-3P,3.8x3.6mm; JLCPCB Part Class: Extended Part; Datasheet: https://atta.szlcsc.com/upload/public/pdf/source/20200810/C720646_BB66A75E654D5E1D30127FF45BCD3C26.pdf; Supplier: LCSC; Tolerance: ±25%; Power(Watts): 150mW; Temperature Coefficient: ±250ppm/℃
R17 = RC0603JR-076K8L: Type:Thick Film Resistors Resistance: Tolerance:±5% Tolerance:±5% Power(Watts): Overload Voltage (Max): Temperature Coefficient:±100ppm/℃ Temperature Coefficient:±100ppm/℃ Operating Temperature Range:-55℃~+155℃ Operating Temperature Range:-55℃~+155℃; LCSC Part Name: 厚膜电阻 6.8kΩ ±5% 100mW; Supplier Part: C127446; Manufacturer: YAGEO(国巨); Supplier Footprint: 0603; JLCPCB Part Class: Extended Part; Datasheet: https://atta.szlcsc.com/upload/public/pdf/source/20180821/C275644_0D56F95EFF785E7D9A1FEF436B37DA78.pdf; Supplier: LCSC; Type: Thick Film Resistors; Tolerance: ±5%; Temperature Coefficient: ±100ppm/℃; Operating Temperature Range: -55℃~+155℃
U16 = BCIHP0420SC-100M: Inductance: Tolerance:±20% Tolerance:±20% Rated Current: Saturation Current (Isat): DC Resistance (DCR):282mΩ Q @ Freq:- Frequency - Self Resonant:-; LCSC Part Name: 10uH ±20% 2A; Supplier Part: C2921170; Manufacturer: BC(台湾诚阳); Supplier Footprint: SMD,4.2x4.4mm; JLCPCB Part Class: Extended Part; Datasheet: https://atta.szlcsc.com/upload/public/pdf/source/20220607/0F62A2B68923DD0945D5F83B99590D06.pdf; Supplier: LCSC; Tolerance: ±20%; DC Resistance (DCR): 282mΩ
U17 = AP3032KTR-G1: Type:DC-DCVoltage Stabilizer Input Voltage:2.7V~9V Input Voltage:2.7V~9V Switch Frequency:1MHz Switch Frequency:1MHz Channels:1 Output Voltage:- Output Voltage:- Output Current:1.4A Dimming:PWM Features:- Topology:boost converter Operating temperature:-40; LCSC Part Name: 输出1.4A 升压型驱动; Supplier Part: C264086; Manufacturer: DIODES(美台); Supplier Footprint: SOT-23-6; JLCPCB Part Class: Extended Part; Datasheet: https://atta.szlcsc.com/upload/public/pdf/source/20180814/C264086_E65DFFCFC0D5B7749C7C40AA828BCF4C.pdf; Supplier: LCSC; Type: DC-DCVoltage Stabilizer; Input Voltage: 2.7V~9V; Switch Frequency: 1MHz; Channels: 1; Output Current: 1.4A; Dimming: PWM; Topology: boost converter; Operating temperature: -40℃~+85℃
U18 = AP3012KTR-G1: Function:boost converterType Output Type:Adjustable Input Voltage:2.6V~16V Input Voltage:2.6V~16V Output Voltage:1.25V~29V Output Voltage:1.25V~29V Output Current (Max):500mA Switching Frequency:1.5MHz Operating Temperature:-40℃~+85℃@(TA) Operating Temper; Supplier Part: C102618; Manufacturer: DIODES(美台); Supplier Footprint: SOT-23-5; JLCPCB Part Class: Extended Part; Datasheet: https://atta.szlcsc.com/upload/public/pdf/source/20191127/C460356_AACB9653A67EC58211AB2AB041FDC9A0.pdf; Supplier: LCSC; Function: boost converterType; Output Type: Adjustable; Input Voltage: 2.6V~16V; Output Voltage: 1.25V~29V; Output Current (Max): 500mA; Switching Frequency: 1.5MHz; Operating Temperature: -40℃~+85℃@(TA); Synchronous Rectification: NO; Number of Outputs: 1; Topology: Boost; Switch tube (built-in/external): 内置
U19 = HPCR0603F33K0K9: Type:Thick Film Resistors Resistance: Tolerance:±1% Tolerance:±1% Power(Watts): Overload Voltage (Max): Temperature Coefficient:±100ppm/℃ Temperature Coefficient:±100ppm/℃ Operating Temperature Range:-55℃~+125℃ Operating Temperature Range:-55℃~+125℃; LCSC Part Name: 厚膜电阻 33kΩ ±1% 200mW; Supplier Part: C365146; Manufacturer: RESI(开步睿思); Supplier Footprint: 0603; JLCPCB Part Class: Extended Part; Datasheet: https://atta.szlcsc.com/upload/public/pdf/source/20200302/C492020_A67DFE56E3A0098A28FA0495227278A6.pdf; Supplier: LCSC; Type: Thick Film Resistors; Tolerance: ±1%; Temperature Coefficient: ±100ppm/℃; Operating Temperature Range: -55℃~+125℃
C1 = 1206B472K102NT: LCSC Part Name: 4.7nF ±10% 1kV; Supplier Part: C9192; Manufacturer: FH(风华); Supplier Footprint: 1206; JLCPCB Part Class: Extended Part; Datasheet: https://atta.szlcsc.com/upload/public/pdf/source/20200305/C486355_26A10D38EF8C2A5C37091D0039909270.pdf; Supplier: LCSC; Tolerance: ±10%
D2 = PRTR5V0U2X,215: polarity:Unidirectional Reverse Stand-Off Voltage (Vrwm):5.5V Breakdown Voltage:6V Number of Lines:双路 Operating Temperature:-40℃~+85℃@(Ta) Operating Temperature:-40℃~+85℃@(Ta) Type:ESD; LCSC Part Name: 单向ESD; Supplier Part: C12333; Manufacturer: Nexperia(安世); Supplier Footprint: SOT-143; JLCPCB Part Class: Extended Part; Datasheet: https://atta.szlcsc.com/upload/public/pdf/source/20171031/C12333_15094491572901070596.pdf; Supplier: LCSC; polarity: Unidirectional; Reverse Stand-Off Voltage (Vrwm): 5.5V; Breakdown Voltage: 6V; Number of Lines: 双路; Operating Temperature: -40℃~+85℃@(Ta); Type: ESD
R1 = ERJ2RKF1004X: LCSC Part Name: 1MΩ ±1% 100mW 厚膜电阻; Supplier Part: C413126; Manufacturer: PANASONIC(松下); Supplier Footprint: 0402; JLCPCB Part Class: Extended Part; Datasheet: https://atta.szlcsc.com/upload/public/pdf/source/20190820/C413126_40A6F45AA8A7BCF3A77EE1B92B10DD48.pdf; Supplier: LCSC; Type: Thick Film Resistors; Tolerance: ±1%; Temperature Coefficient: ±100ppm/℃; Operating Temperature Range: -55℃~+155℃
R2 R3 = RMC04025.1K1%N: LCSC Part Name: 5.1kΩ ±1% 62.5mW; Supplier Part: C325521; Manufacturer: Tyohm(幸亚电阻); Supplier Footprint: 0402; JLCPCB Part Class: Extended Part; Datasheet: https://atta.szlcsc.com/upload/public/pdf/source/20190115/C325956_D27151D492FFB3C9AB4A6F14FE01F30A.pdf; Supplier: LCSC; Tolerance: ±1%
USB1 = TYPE-C 16PIN 2MD(073): LCSC Part Name: Type-C 母 卧贴; Supplier Part: C2765186; Manufacturer: SHOU HAN(首韩); Supplier Footprint: SMD; JLCPCB Part Class: Extended Part; Datasheet: https://atta.szlcsc.com/upload/public/pdf/source/20211123/39B17C16241EAC15C5E277BDA434118E.pdf; Supplier: LCSC; Connector Type: Type-C; Standard: USB 3.1; Gender: Female; Mounting Style: Horizontal attachment; Number of Contacts: 16P; Number of Ports: 1; Current Rating - Power (Max): 5A; Operating Temperature Range: -25℃~+85℃; Rated Voltage (Max): 5V; Connect-Disconnect Life: 5000 Cuts; Core Colour: Black

## Nets
3V3: C18.2 C37.2 C38.2 C40.2 C41.2 C42.2 C43.2 FPC1.7 FPC1.39 FPC1.40 FPC1.56 R18.1 R19.2 R20.2 R22.2 R23.2 R24.2 R27.2 U13.1 U14.1(OUT) U14.2(OUT) U14.3(SENSE) U20.2(3V3) U21.1(VCC) ; also on sheet 5 6 7 8 9 10 11 12 14 15 16 17
+5V: C13.2 C17.2 C26.2 C30.2 C31.2 D1.1 D3.1 L2.1 R10.2 U4.1 U5.1(VIN) U14.5(EN) U14.7(VIN) U14.8(VIN) U16.1 U17.6(VIN) U18.5(VIN) ; also on sheet 14 15
+5V(ISO): C14.2 C15.2 U5.6(+VO) U6.1 ; also on sheet 5 9 15
+12V: C8.1 C9.2 C10.1 C11.2 R5.2 U2.1 U9.1(VIN) U10.2 ; also on sheet 13 15 16
+24V: C2.2 C5.2 C6.1 C7.2 Q1.5(D) Q1.6(D) Q1.7(D) Q1.8(D) U1.1 U8.5(VIN) ; also on sheet 15 16
AVDD_LCD: C32.2 C33.2 C34.2 D11.1(A) D12.1(C) FPC1.43 R13.2 U19.2
GND: C1.1 C5.1 C6.2 C7.1 C8.2 C9.1 C10.2 C11.1 C12.2 C13.1 C16.2 C17.1 C18.1 C19.1 C20.1 C21.1 C23.1 C24.1 C25.1 C26.1 C28.1 C29.1 C30.1 C31.1 C32.1 C33.1 C34.1 C35.2 C36.1 C37.1 C38.1 C39.1 C40.1 C41.1 C42.1 C43.1 D4.1 D5.2(A) D6.2(A) D7.1 D8.2(K) D10.2(A) FPC1.5 FPC1.17 FPC1.18 FPC1.19 FPC1.26 FPC1.27 FPC1.33 FPC1.34 FPC1.35 FPC1.36 FPC1.38 FPC1.48 FPC1.57 FPC1.61 FPC1.62 R1.1 R2.1 R3.1 R4.2 R7.1 R9.1 R11.1 R12.1 R14.1 R16.1 R17.1 R21.1 R25.1 R26.2 SW1.1 SW2.1 U5.2(GND) U7.2 U8.1(GND) U9.3(GND) U9.6(GND) U11.2(GND) U12.1 U14.6(GND) U14.9(EP) U15.1 U17.2(GND) U18.2(GND) U20.1(GND) U20.40(GND) U20.41(GND) U21.2(GND) U21.5(GND) USB1.1(GND) USB1.12(GND) ; also on sheet 5 6 7 8 9 10 11 12 13 14 15 16 17
GND(ISO): C14.1 C15.1 U5.4(0V) ; also on sheet 5 9 15
VBUS: D1.2 D2.4(VCC) USB1.2(VBUS) USB1.11(VBUS)
AI_SCL: FPC1.60 R19.1 U20.17(IO9) U21.6(BUS1) ; also on sheet 6 8 11 13 17
AI_SDA: FPC1.59 R20.1 U20.12(IO8) U21.4(BUS2) ; also on sheet 6 8 11 13 17
B3: FPC1.16 U20.22(IO14)
B4: FPC1.15 U20.31(IO38)
B5: FPC1.14 U20.11(IO18)
B6: FPC1.13 U20.10(IO17)
B7: FPC1.12 U20.18(IO10)
BOOT: FPC1.24 R23.1 SW2.2 U20.27(IO0)
CC1: R2.2 USB1.4(CC1)
CC2: R3.2 USB1.10(CC2)
CTP_IRQ: FPC1.58 U20.4(IO4)
CTP_RST: FPC1.55 ; also on sheet 8
DE: FPC1.9 U20.5(IO5)
DISP: R10.1 U17.4(CTRL) ; also on sheet 8
ESP_USB_N: D2.3(IO2) U20.13(IO19) USB1.5(DN2) USB1.7(DN1)
ESP_USB_P: D2.2(IO1) U20.14(IO20) USB1.6(DP1) USB1.8(DP2)
EXTIO2: FPC1.44 R24.1 ; also on sheet 8
EXTIO3: R14.2 U18.4(nSHDN) ; also on sheet 8
FB_5V: C12.1 D3.2 L1.2 U9.4(FB)
FB_12V: R5.1 U8.2(FB) U12.2
FL_MISO: U20.21(IO13) ; also on sheet 7 14
FL_MOSI: U20.19(IO11) ; also on sheet 7 14
FL_SCK: U20.20(IO12) ; also on sheet 7 14
G2: FPC1.25 U20.32(IO39)
G4: FPC1.23 R21.2 U20.26(IO45)
G5: FPC1.22 U20.25(IO48)
G6: FPC1.21 U20.24(IO47)
G7: FPC1.20 U20.23(IO21)
HSYNC: FPC1.11 R25.2 U20.16(IO46)
IO1: FPC1.32 U20.39(IO1)
IO2: FPC1.31 U20.38(IO2)
IO3: FPC1.10 U20.15(IO3)
IO6: U20.6(IO6) ; also on sheet 15
IO7: FPC1.37 U20.7(IO7)
IO15: U20.8(IO15) ; also on sheet 5 15
IO16: U20.9(IO16) ; also on sheet 5 15
IO40: FPC1.28 U20.33(IO40)
IO41: FPC1.29 U20.34(IO41)
IO42: FPC1.30 U20.35(IO42)
OUT_5V: D6.1(C) L1.1 U9.2(OUT)
RESET: C39.2 R22.1 SW1.2 U20.3(EN)
RXD0: U20.36(RXD0) ; also on sheet 14 15
SHELL: C1.2 D2.1(GND) R1.2 USB1.13(SHELL) USB1.14(SHELL)
SW_12V: D5.1(K) U8.6(SW) U10.1
TXD0: U20.37(TXD0) ; also on sheet 14 15
VCOM: C35.1 C36.2 FPC1.6 FPC1.46 R15.2
VGH: C24.2 C25.2 D10.1(K) FPC1.41 R8.2 R9.2
VGL: C20.2 C21.2 D7.2 FPC1.42 R6.2 R7.2
VLED+: C28.2 C29.2 D9.1(C) FPC1.1 FPC1.2 U17.5(OV)
VLED-: FPC1.3 FPC1.4 R11.2 R12.2 U17.3(FB)
$1N46888: C2.1 U8.4(VC)
$1N48629: R4.1 U9.5(ON/OFF)
$1N53018: U14.4(SS) U15.2
$1N65107: C3.2 C16.1
$1N65108: C4.1 U11.4(VCAP)
$1N65110: Q1.4(G) U11.6(GATE)
$1N65111: C3.1 C4.2 D4.2 Q1.1(S) Q1.2(S) Q1.3(S) U3.1 U11.1(EN) U11.5(SOURCE)
$1N85642: U3.2 U7.1
$2N6388: FPC1.8 R18.2
$2N10650: FPC1.47 R26.1
$2N81645: R27.1 U21.3(ENABLE)
$4N1112: D9.2(A) U16.2 U17.1(SW)
$4N2833: R16.2 U18.3(FB) U19.1
$4N3067: C27.1 D11.3
$4N3628: C22.2 C27.2 D12.2(A) L2.2 U18.1(SW)
$4N3848: C23.2 D11.2(K) R8.1
$4N7536: R15.3 R17.2
$4N7577: R13.1 R15.1
$4N13802: C19.2 D8.1(A) R6.1
$4N13806: C22.1 D8.3

Not connected (* = marked no-connect by the designer): FPC1 45* 49* 50* 51* 52* 53* 54*; U3 3*; U8 3(SW)*; U11 3(N.C)* 7(N.C)* 8(N.C)*; U20 28(IO35)* 29(IO36)* 30(IO37)*; USB1 3(SBU2)* 9(SBU1)*

## Notes on the sheets
sheet 1
- Power Supply
- Buck Convertor
- Buck Convertor
- Input : 15VDC - 36VDC
- Input : 12V 5A
- Output : 5V 3A and Isolated 5V 3A
- Isolated 5V
- Output : 12V 5A
- LDO
- Input : 5V 3A
- Output : 3.3V 2A
- Links:
- 1. https://www.ti.com/lit/ug/snou172/snou172.pdf?ts=1728768049324&ref_url=https%253A%252F%252Fwww.google.com%252F
- 2. https://www.lcsc.com/datasheet/lcsc_datasheet_1811081616_XLSEMI-XL4015E1_C51661.pdf
- 3. https://www.lcsc.com/datasheet/lcsc_datasheet_2304140030_XLSEMI-XL1507-ADJE1_C74194.pdf
- 4. https://www.lcsc.com/datasheet/lcsc_datasheet_2004231133_Analog-Devices-ADM7172ACPZ-3-3-R7_C514342.pdf
sheet 2
- FPC Connector
- (7inch LCD & Touch)
- Pin Mapping
- Buzzer
- I2C RTC
- ESP32
- I2C
- Digital Outputs
- USB
- SPI
- RGB LED
- RS485
- UART Header
- Digital Inputs
- I2C Pull-up resistor
- SPI SD Card
- 7inch LCD Touchscreen
- I2C Temp Sensor
- SPI NAND Flash
- Push Button
- Strapping Pins
- I2C I/O Expander
- SPI LORA Header
- Enable/Reset
- Boot
- I2C Analog Input
- Pilot Lamp
- I2C Analog Output
- I2C Touchscreen
- I2C Extender
- ADDR : 0x5D
- Links:
- 1. https://www.waveshare.com/wiki/ESP32-S3-Touch-LCD-7
sheet 3
- USB
- USB Type-C
- EDS Protection
- Links:
- 1. SCH_ESP32_RelayControl_2024-06-12.pdf
- 2. https://www.waveshare.com/wiki/R7FA4_PLUS_B
sheet 4
- Touch Power Supply
- Panel Voltage
- Backlight
- +16V
- 9.85V
- VCOM: 3.1V-5.3V
- Links:
- 1. https://www.waveshare.com/wiki/ESP32-S3-Touch-LCD-7
